# EAGLE design MotorControl (EAGLE 7.5.0)

## Sheet 1 of 4
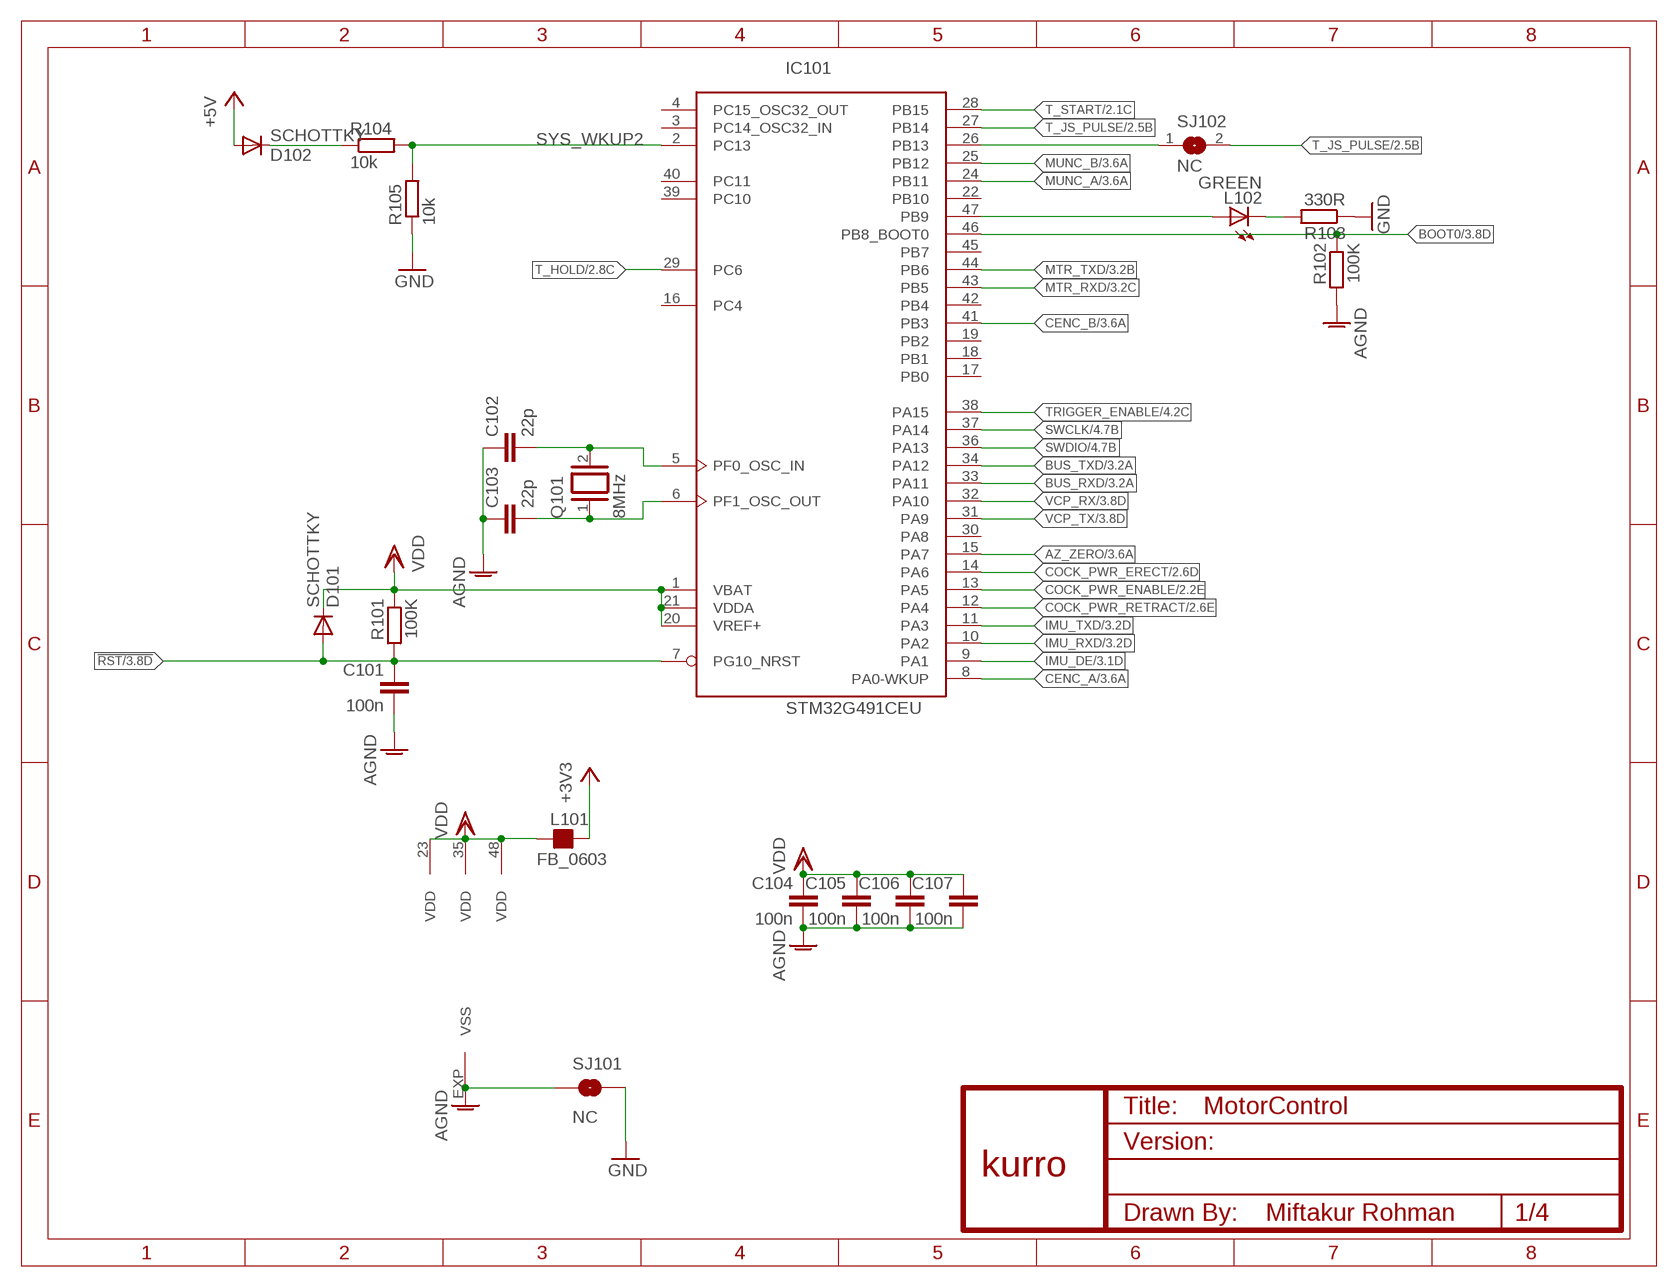
[diagram p0: schematic, sheet 1]

### Parts
C101  100n  C-EUC0603  [C0603]
C102  22p  C-EUC0603  [C0603]
C103  22p  C-EUC0603  [C0603]
C104  100n  C-EUC0603  [C0603]
C105  100n  C-EUC0603  [C0603]
C106  100n  C-EUC0603  [C0603]
C107  100n  C-EUC0603  [C0603]
D101  SCHOTTKY  DIODE-MICROMELF-W  [MICROMELF-W]
D102  SCHOTTKY  DIODE-MICROMELF-W  [MICROMELF-W]
IC101  STM32G491CEU  [UFQFPN48]
L101  FB_0603  [L0603]
L102  GREEN  LEDCHIP-LED0805  [CHIP-LED0805]
Q101  8MHz  XTAL/S  [QS]
R101  100K  R-EU_R0603  [R0603]
R102  100K  R-EU_R0603  [R0603]
R103  330R  R-EU_R0603  [R0603]
R104  10k  R-EU_R0603  [R0603]
R105  10k  R-EU_R0603  [R0603]
SJ101  NC  SOLDERJUMPERTRACE_THICK  [SJ_2S-TRACE_THICK]
SJ102  NC  SJS  [SJS]
U$1  KURRO_FOOTPRINT  [KURRO-LOGO]

### Nets
!RST [ic]: C101.1 D101.A IC101.7(PG10_NRST) R101.2 ; also sheet 3
+3V3: L101.2 ; also sheet 2,3
+5V: D102.A ; also sheet 2,3,4
AGND [ic]: C101.2 C102.1 C103.1 C104.2 C105.2 C106.2 C107.2 IC101.EXP(VSS) R102.2 SJ101.1
AZ_ZERO [ic]: IC101.15(PA7) ; also sheet 3
BOOT0 [ic]: IC101.46(PB8_BOOT0) R102.1 ; also sheet 3
BUS_RXD [ic]: IC101.33(PA11) ; also sheet 3
BUS_TXD [ic]: IC101.34(PA12) ; also sheet 3
CENC_A: IC101.8(PA0-WKUP) ; also sheet 3
CENC_B: IC101.41(PB3) ; also sheet 3
COCK_PWR_ENABLE [ic]: IC101.13(PA5) ; also sheet 2
COCK_PWR_ERECT [ic]: IC101.14(PA6) ; also sheet 2
COCK_PWR_RETRACT [ic]: IC101.12(PA4) ; also sheet 2
GND: R103.1 R105.1 SJ101.2 ; also sheet 2,3,4
IMU_DE: IC101.9(PA1) ; also sheet 3
IMU_RXD: IC101.10(PA2) ; also sheet 3
IMU_TXD: IC101.11(PA3) ; also sheet 3
MTR_RXD [ic]: IC101.43(PB5) ; also sheet 3
MTR_TXD [ic]: IC101.44(PB6) ; also sheet 3
MUNC_A: IC101.24(PB11) ; also sheet 3
MUNC_B: IC101.25(PB12) ; also sheet 3
N$4: IC101.47(PB9) L102.A
N$9: L102.C R103.2
N$11: D102.C R104.1
N$25 [ic]: C103.2 IC101.6(PF1_OSC_OUT) Q101.1
N$26: IC101.26(PB13) SJ102.1
N$31 [ic]: C102.2 IC101.5(PF0_OSC_IN) Q101.2
SWCLK [ic]: IC101.37(PA14) ; also sheet 4
SWDIO [ic]: IC101.36(PA13) ; also sheet 4
SYS_WKUP2: IC101.2(PC13) R104.2 R105.2
T_HOLD: IC101.29(PC6) ; also sheet 2
T_JS_PULSE: IC101.27(PB14) SJ102.2 ; also sheet 2
T_START: IC101.28(PB15) ; also sheet 2
TRIGGER_ENABLE [ic]: IC101.38(PA15) ; also sheet 4
VCP_RX [ic]: IC101.32(PA10) ; also sheet 3,4
VCP_TX [ic]: IC101.31(PA9) ; also sheet 3,4
VDD [ic]: C104.1 C105.1 C106.1 C107.1 D101.C IC101.1(VBAT) IC101.20(VREF+) IC101.21(VDDA) IC101.23(VDD) IC101.35(VDD) IC101.48(VDD) L101.1 R101.1 ; also sheet 2,4
Unconnected: IC101.3(PC14_OSC32_IN) IC101.4(PC15_OSC32_OUT) IC101.16(PC4) IC101.17(PB0) IC101.18(PB1) IC101.19(PB2) IC101.22(PB10) IC101.30(PA8) IC101.39(PC10) IC101.40(PC11) IC101.42(PB4) IC101.45(PB7)

## Sheet 2 of 4
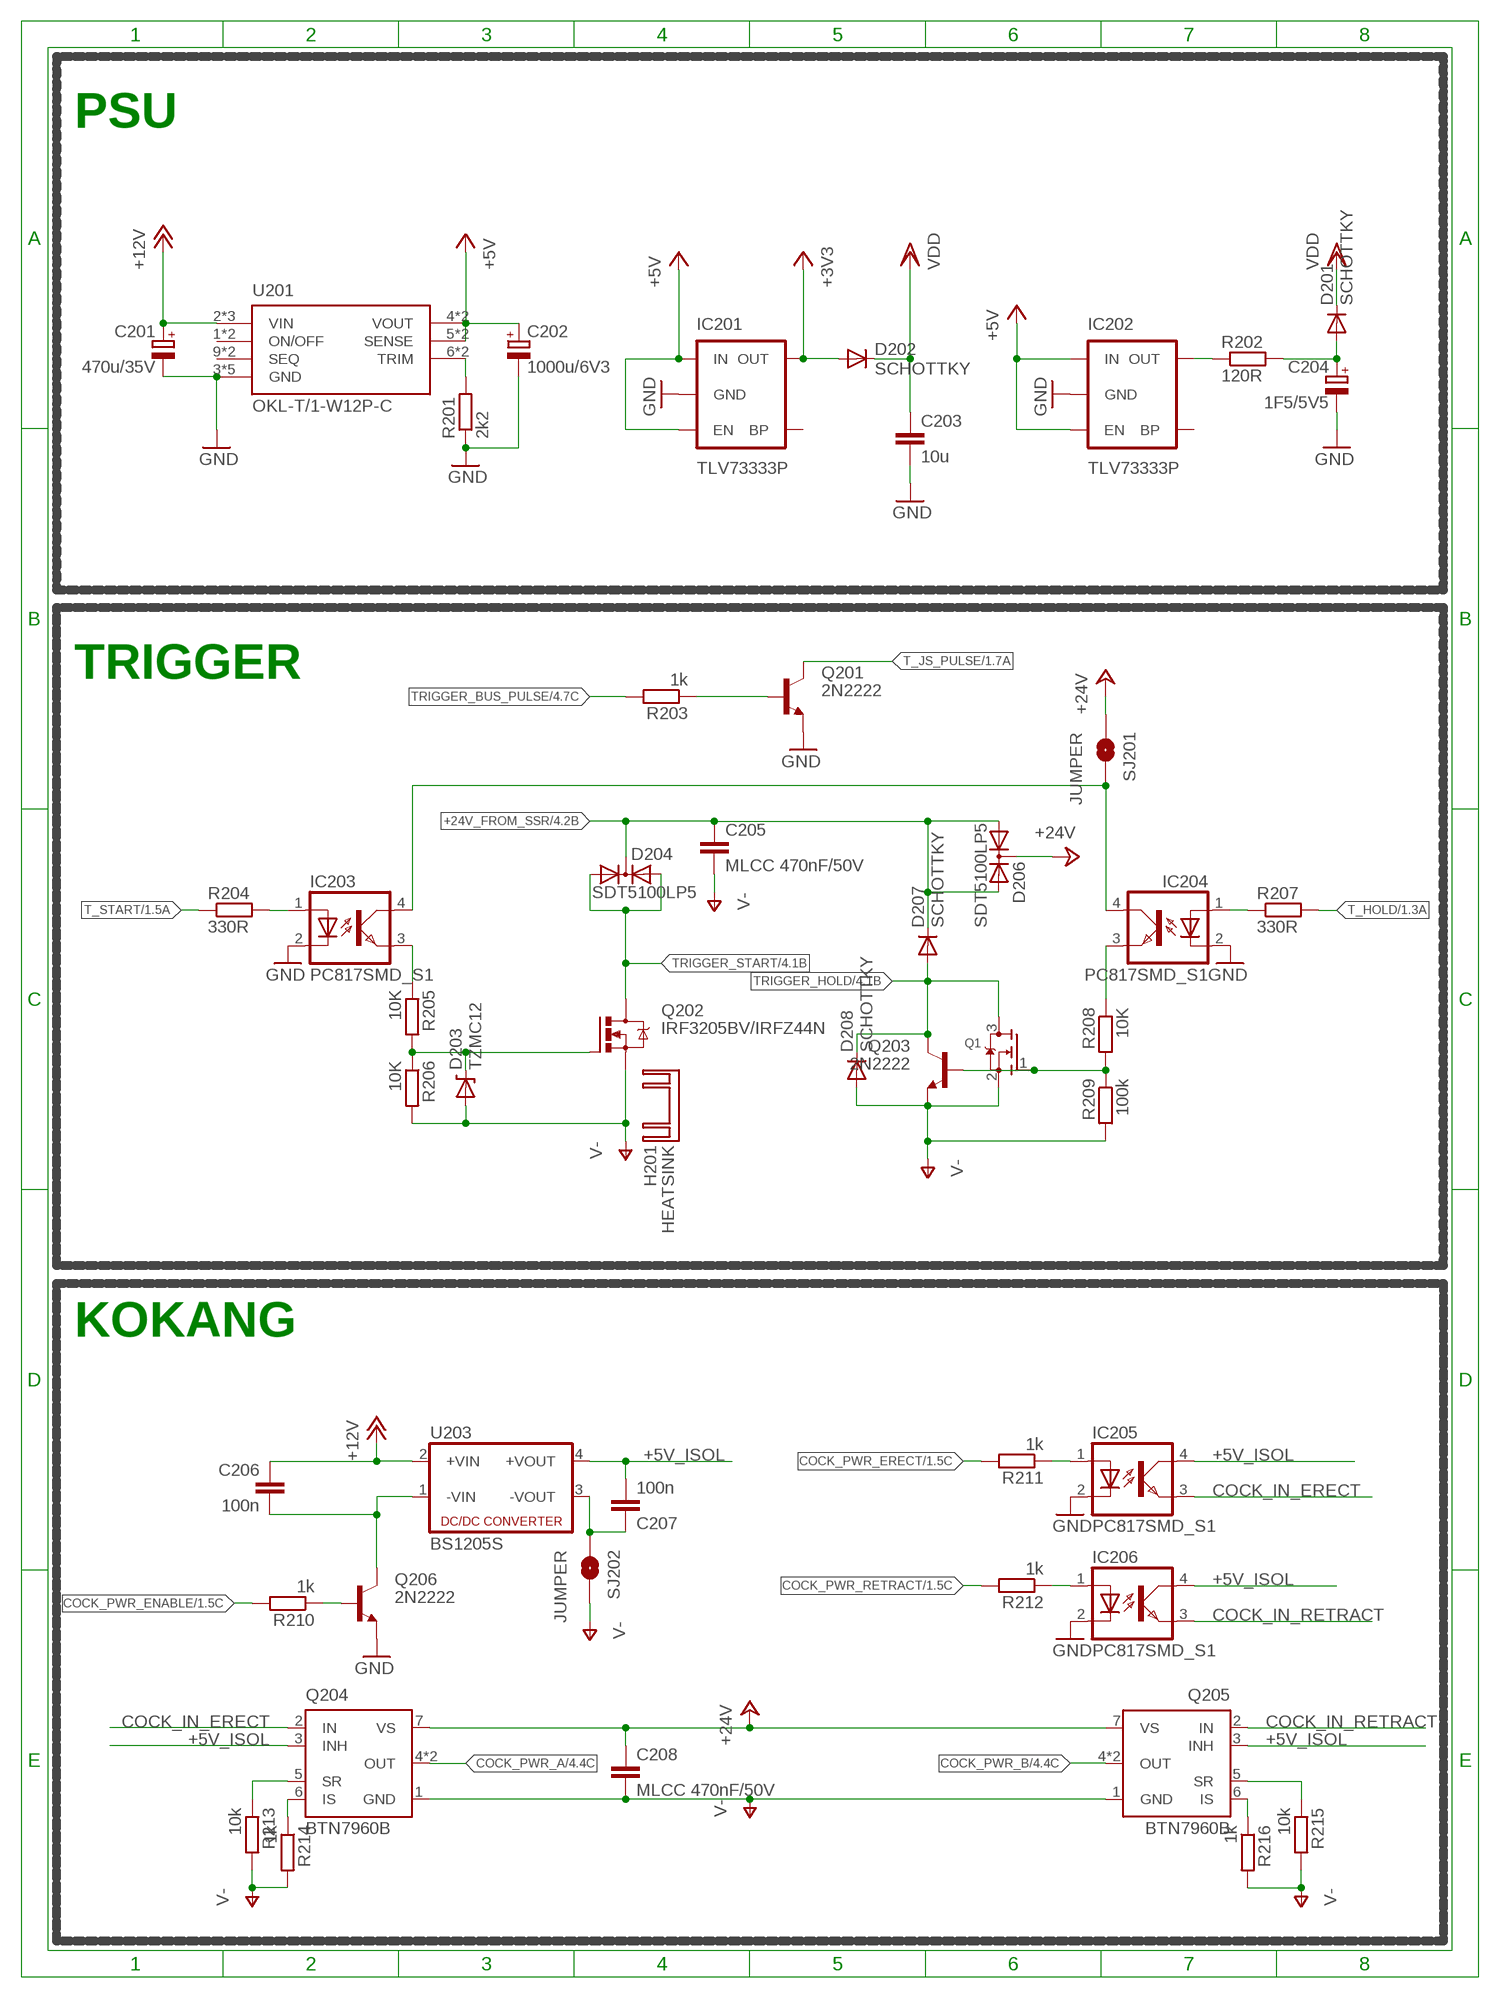
[diagram p1: schematic, sheet 2]

### Parts
C201  470u/35V  CPOL-EU153CLV-1012  [153CLV-1012]
C202  1000u/6V3  CPOL-EU153CLV-0810  [153CLV-0810]
C203  10u  C-EUC0805  [C0805]
C204  1F5/5V5  SUPER_CAP_1F/5V5  [SC_1F/5V5]
C205  MLCC 470nF/50V  C-EU150-064X183  [C150-064X183]
C206  100n  C-EUC0603  [C0603]
C207  100n  C-EUC0603  [C0603]
C208  MLCC 470nF/50V  C-EU150-064X183  [C150-064X183]
D201  SCHOTTKY  DIODE-MICROMELF-W  [MICROMELF-W]
D202  SCHOTTKY  DIODE-MICROMELF-W  [MICROMELF-W]
D203  TZMC12  DIODE-ZENERSMB  [SMB-DIODE]
D204  SDT5100LP5  [POWERDI5-3]
D206  SDT5100LP5  [POWERDI5-3]
D207  SCHOTTKY  DIODE-MICROMELF-W  [MICROMELF-W]
D208  SCHOTTKY  DIODE-MICROMELF-W  [MICROMELF-W]
H201  HEATSINK  TO220T25-HOLE  [BV_240X170-HOLE]
IC201  TLV73333P  V_REG_LDOSMD  [SOT23-5]
IC202  TLV73333P  V_REG_LDOSMD  [SOT23-5]
IC203  PC817SMD_S1  [PC817SMD]
IC204  PC817SMD_S1  [PC817SMD]
IC205  PC817SMD_S1  [PC817SMD]
IC206  PC817SMD_S1  [PC817SMD]
Q1  AO3404-REFLOW  [SOT23]
Q201  2N2222  2N2222-REFLOW  [SOT23]
Q202  IRF3205BV/IRFZ44N  IRF3205BV  [TO220BV]
Q203  2N2222  2N2222-REFLOW  [SOT23]
Q204  BTN7960B  BTN8982  [PG-TO263-7-1]
Q205  BTN7960B  BTN8982  [PG-TO263-7-1]
Q206  2N2222  2N2222-REFLOW  [SOT23]
R201  2k2  R-EU_R0603  [R0603]
R202  120R  R-EU_R0603  [R0603]
R203  1k  R-EU_R0603  [R0603]
R204  330R  R-EU_R0603  [R0603]
R205  10K  R-EU_R0603  [R0603]
R206  10K  R-EU_R0603  [R0603]
R207  330R  R-EU_R0603  [R0603]
R208  10K  R-EU_R0603  [R0603]
R209  100k  R-EU_R0603  [R0603]
R210  1k  R-EU_R0603  [R0603]
R211  1k  R-EU_R0603  [R0603]
R212  1k  R-EU_R0603  [R0603]
R213  10k  R-EU_R0603  [R0603]
R214  1k  R-EU_R0603  [R0603]
R215  10k  R-EU_R0603  [R0603]
R216  1k  R-EU_R0603  [R0603]
SJ201  JUMPER  SOLDERJUMPERTRACE_THICK  [SJ_2S-TRACE_THICK]
SJ202  JUMPER  SOLDERJUMPERTRACE_THICK  [SJ_2S-TRACE_THICK]
U201  OKL-T/1-W12P-C  OKL2T/3W5NC_SMD  [OKL2T/3W5NC]
U203  BS1205S  NME  [NME]

### Nets
+3V3: D202.A IC201.5(OUT) ; also sheet 1,3
+5V: C202.+ IC201.1(IN) IC201.3(EN) IC202.1(IN) IC202.3(EN) U201.4(VOUT) U201.4@1(VOUT) U201.5(SENSE) U201.5@1(SENSE) ; also sheet 1,3,4
+5V_ISOL: C207.2 IC205.4(COL) IC206.4(COL) Q204.3(INH) Q205.3(INH) U203.4(+VOUT)
+12V [power]: C201.+ C206.1 U201.2(VIN) U201.2@1(VIN) U201.2@2(VIN) U203.2(+VIN) ; also sheet 4
+24V [power]: C208.1 D206.3 Q204.7(VS) Q205.7(VS) SJ201.1 ; also sheet 4
+24V_FROM_SSR [power]: C205.1 D204.3 D206.1 D206.2 D207.C ; also sheet 4
COCK_IN_ERECT: IC205.3(EMIT) Q204.2(IN)
COCK_IN_RETRACT: IC206.3(EMIT) Q205.2(IN)
COCK_PWR_A [power]: Q204.4(OUT) Q204.8(OUT) ; also sheet 4
COCK_PWR_B [power]: Q205.4(OUT) Q205.8(OUT) ; also sheet 4
COCK_PWR_ENABLE [ic]: R210.2 ; also sheet 1
COCK_PWR_ERECT [ic]: R211.2 ; also sheet 1
COCK_PWR_RETRACT [ic]: R212.2 ; also sheet 1
COCK_SENSOR1: Q204.6(IS) R214.1
GND: C201.- C202.- C203.2 C204.2(-) IC201.2(GND) IC202.2(GND) IC203.2(C) IC204.2(C) IC205.2(C) IC206.2(C) Q201.2(E) Q206.2(E) R201.1 U201.3(GND) U201.3@1(GND) U201.3@2(GND) U201.7(GND) U201.7@1(GND) ; also sheet 1,3,4
N$1: IC203.4(COL) IC204.4(COL) SJ201.2
N$5: Q204.5(SR) R213.1
N$6: Q205.5(SR) R215.1
N$7: Q205.6(IS) R216.1
N$15: Q206.1(B) R210.1
N$16: C206.2 Q206.3(C) U203.1(-VIN)
N$17: Q201.1(B) R203.1
N$18: IC205.1(A) R211.1
N$19: R201.2 U201.6(TRIM) U201.6@1(TRIM)
N$22: IC206.1(A) R212.1
N$24: C207.1 SJ202.1 U203.3(-VOUT)
N$38: D203.C Q202.G R205.2 R206.1
N$40: Q1.1(G) Q203.1(B) R208.2 R209.1
N$41: IC203.3(EMIT) R205.1
N$42: IC204.3(EMIT) R208.1
N$43: IC204.1(A) R207.1
N$44: IC203.1(A) R204.2
N$46: IC202.5(OUT) R202.1
T_HOLD: R207.2 ; also sheet 1
T_JS_PULSE: Q201.3(C) ; also sheet 1
T_START: R204.1 ; also sheet 1
TRIGGER_BUS_PULSE [ic]: R203.2 ; also sheet 4
TRIGGER_HOLD [power]: D207.A D208.C Q1.3(D) Q203.3(C) ; also sheet 4
TRIGGER_START [power]: D204.1 D204.2 Q202.D ; also sheet 4
V- [power]: C205.2 C208.2 D203.A D208.A Q1.2(S) Q202.S Q203.2(E) Q204.1(GND) Q205.1(GND) R206.2 R209.2 R213.2 R214.2 R215.2 R216.2 SJ202.2 ; also sheet 4
V_SCAP: C204.1(+) D201.A R202.2
VDD [ic]: C203.1 D201.C D202.C ; also sheet 1,4
Unconnected: IC201.4(BP) IC202.4(BP) U201.1(ON/OFF) U201.1@1(ON/OFF) U201.9(SEQ) U201.9@1(SEQ)

### Notes on the sheet
- PSU
- TRIGGER
- KOKANG

## Sheet 3 of 4
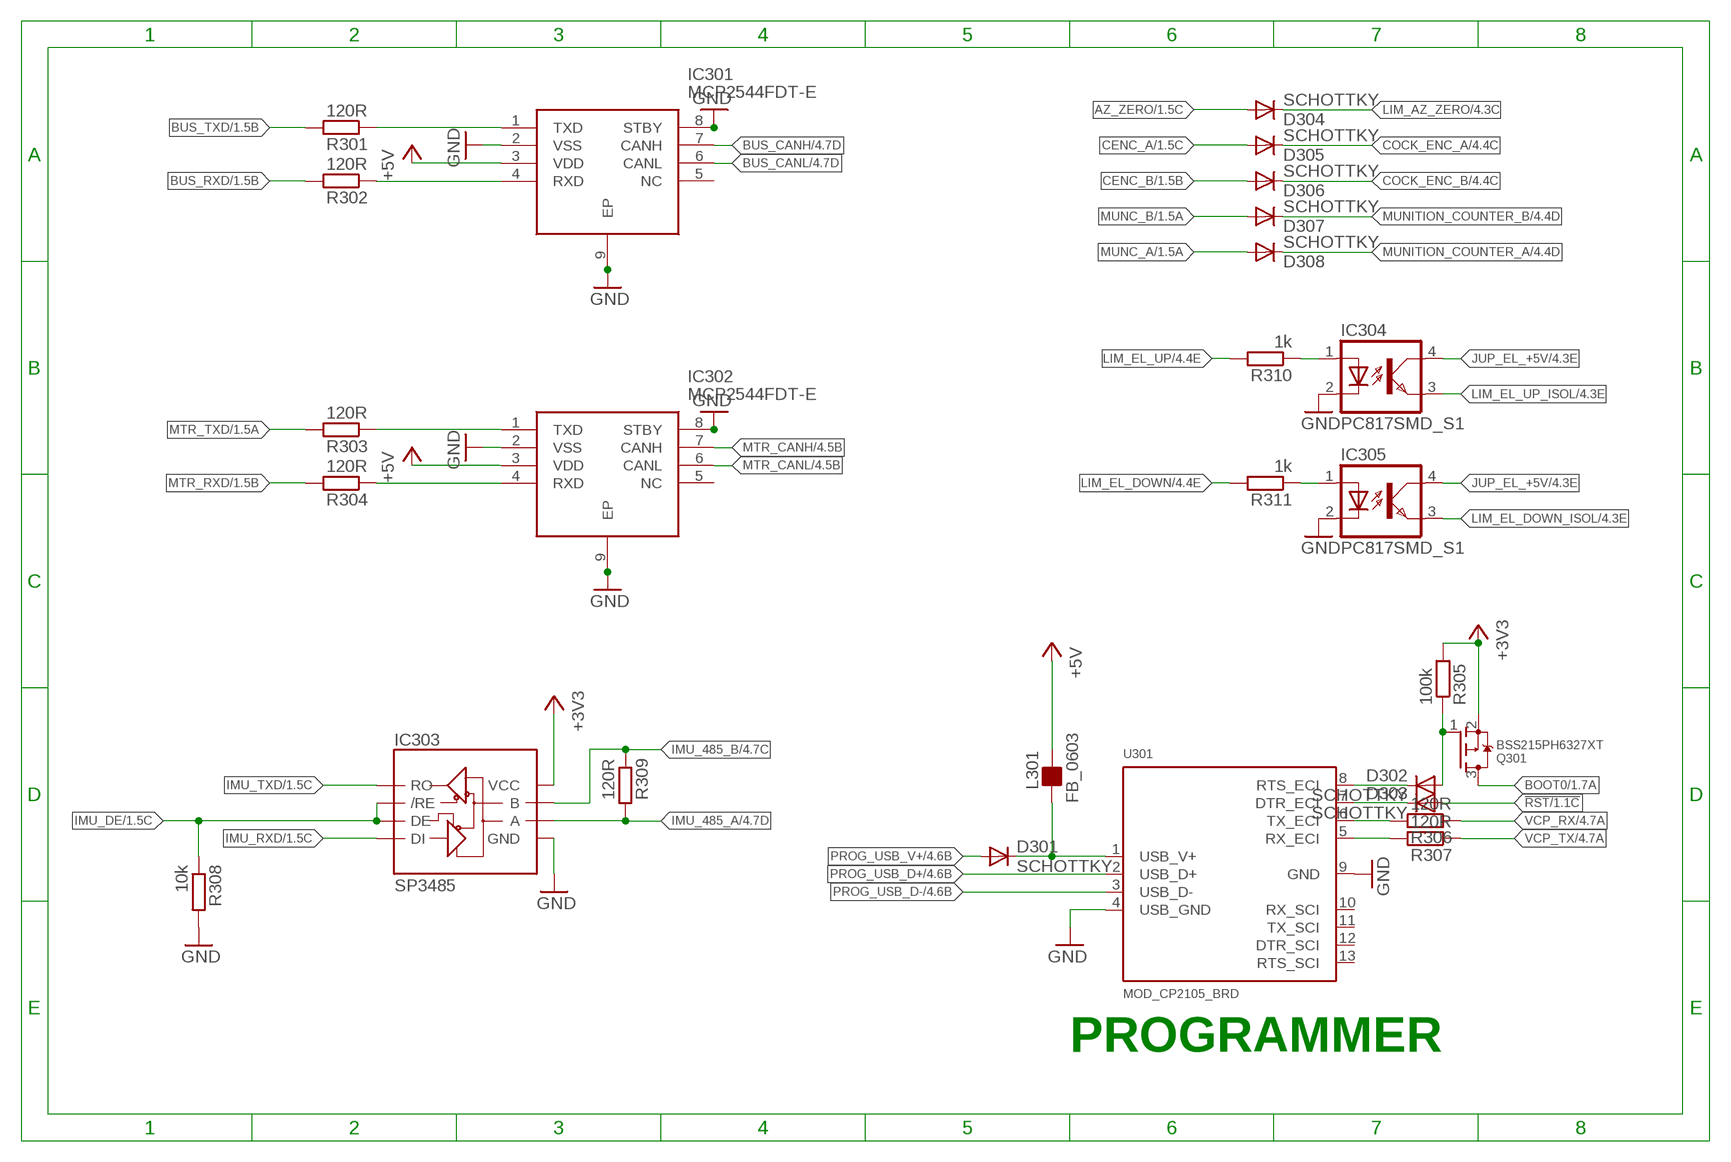
[diagram p2: schematic, sheet 3]

### Parts
D301  SCHOTTKY  DIODE-MICROMELF-W  [MICROMELF-W]
D302  SCHOTTKY  DIODE-MICROMELF-W  [MICROMELF-W]
D303  SCHOTTKY  DIODE-MICROMELF-W  [MICROMELF-W]
D304  SCHOTTKY  DIODE-MICROMELF-W  [MICROMELF-W]
D305  SCHOTTKY  DIODE-MICROMELF-W  [MICROMELF-W]
D306  SCHOTTKY  DIODE-MICROMELF-W  [MICROMELF-W]
D307  SCHOTTKY  DIODE-MICROMELF-W  [MICROMELF-W]
D308  SCHOTTKY  DIODE-MICROMELF-W  [MICROMELF-W]
IC301  MCP2544FDT-E  [TDFN-8]
IC302  MCP2544FDT-E  [TDFN-8]
IC303  SP3485  RS485SOIC  [SO08]
IC304  PC817SMD_S1  [PC817SMD]
IC305  PC817SMD_S1  [PC817SMD]
L301  FB_0603  [L0603]
Q301  BSS215PH6327XT  A03401-WIDE  [SOT23-W]
R301  120R  R-EU_R0603  [R0603]
R302  120R  R-EU_R0603  [R0603]
R303  120R  R-EU_R0603  [R0603]
R304  120R  R-EU_R0603  [R0603]
R305  100k  R-EU_R0603  [R0603]
R306  120R  R-EU_R0603  [R0603]
R307  120R  R-EU_R0603  [R0603]
R308  10k  R-EU_R0603  [R0603]
R309  120R  R-EU_R0603  [R0603]
R310  1k  R-EU_R0603  [R0603]
R311  1k  R-EU_R0603  [R0603]
U301  MOD_CP2105_BRD  [MOD_CP2105_BOARD]

### Nets
!RST [ic]: D303.A ; also sheet 1
+3V3: IC303.8(VCC) Q301.2(S) R305.2 ; also sheet 1,2
+5V: IC301.3(VDD) IC302.3(VDD) L301.2 ; also sheet 1,2,4
AZ_ZERO [ic]: D304.A ; also sheet 1
BOOT0 [ic]: Q301.3(D) ; also sheet 1
BUS_CANH: IC301.7(CANH) ; also sheet 4
BUS_CANL: IC301.6(CANL) ; also sheet 4
BUS_RXD [ic]: R302.2 ; also sheet 1
BUS_TXD [ic]: R301.2 ; also sheet 1
CENC_A: D305.A ; also sheet 1
CENC_B: D306.A ; also sheet 1
COCK_ENC_A: D305.C ; also sheet 4
COCK_ENC_B: D306.C ; also sheet 4
GND: IC301.2(VSS) IC301.8(STBY) IC301.9(EP) IC302.2(VSS) IC302.8(STBY) IC302.9(EP) IC303.5(GND) IC304.2(C) IC305.2(C) R308.2 U301.4(USB_GND) U301.9(GND) ; also sheet 1,2,4
IMU_485_A: IC303.6(A) R309.2 ; also sheet 4
IMU_485_B: IC303.7(B) R309.1 ; also sheet 4
IMU_DE: IC303.2(/RE) IC303.3(DE) R308.1 ; also sheet 1
IMU_RXD: IC303.4(DI) ; also sheet 1
IMU_TXD: IC303.1(RO) ; also sheet 1
JUP_EL_+5V: IC304.4(COL) IC305.4(COL) ; also sheet 4
LIM_AZ_ZERO [ic]: D304.C ; also sheet 4
LIM_EL_DOWN: R311.2 ; also sheet 4
LIM_EL_DOWN_ISOL: IC305.3(EMIT) ; also sheet 4
LIM_EL_UP: R310.2 ; also sheet 4
LIM_EL_UP_ISOL: IC304.3(EMIT) ; also sheet 4
MTR_CANH: IC302.7(CANH) ; also sheet 4
MTR_CANL: IC302.6(CANL) ; also sheet 4
MTR_RXD [ic]: R304.2 ; also sheet 1
MTR_TXD [ic]: R303.2 ; also sheet 1
MUNC_A: D308.A ; also sheet 1
MUNC_B: D307.A ; also sheet 1
MUNITION_COUNTER_A: D308.C ; also sheet 4
MUNITION_COUNTER_B: D307.C ; also sheet 4
N$3: IC304.1(A) R310.1
N$8: R307.2 U301.5(RX_ECI)
N$10: R306.2 U301.6(TX_ECI)
N$12: D303.C U301.7(DTR_ECI)
N$13: D302.C U301.8(RTS_ECI)
N$14: D301.C L301.1 U301.1(USB_V+)
N$20: D302.A Q301.1(G) R305.1
N$21: IC305.1(A) R311.1
N$34: IC301.4(RXD) R302.1
N$35: IC301.1(TXD) R301.1
N$36: IC302.4(RXD) R304.1
N$37: IC302.1(TXD) R303.1
PROG_USB_D+: U301.2(USB_D+) ; also sheet 4
PROG_USB_D-: U301.3(USB_D-) ; also sheet 4
PROG_USB_V+: D301.A ; also sheet 4
VCP_RX [ic]: R306.1 ; also sheet 1,4
VCP_TX [ic]: R307.1 ; also sheet 1,4
Unconnected: IC301.5(NC) IC302.5(NC) U301.10(RX_SCI) U301.11(TX_SCI) U301.12(DTR_SCI) U301.13(RTS_SCI)

### Notes on the sheet
- PROGRAMMER

## Sheet 4 of 4
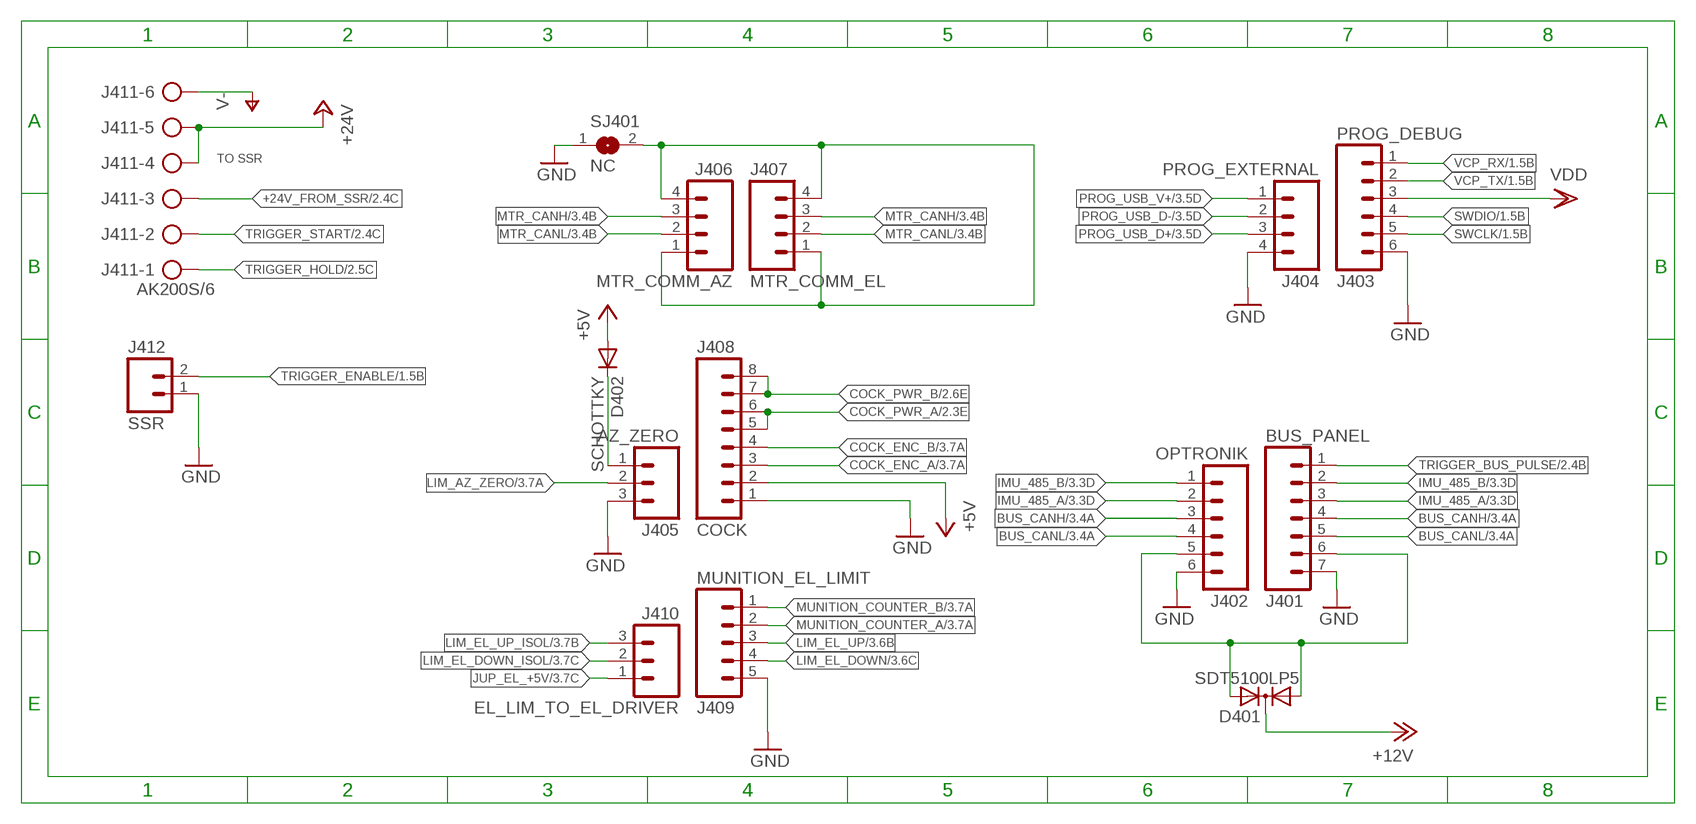
[diagram p3: schematic, sheet 4]

### Parts
D401  SDT5100LP5  [POWERDI5-3]
D402  SCHOTTKY  DIODE-MICROMELF-W  [MICROMELF-W]
J401  BUS_PANEL  M07-XHS-RA  [XHS-7-RA]
J402  OPTRONIK  M06-XHS-RA  [XHS-6-RA]
J403  PROG_DEBUG  M06-XHS-VERT-SMD  [XHS-6-VERT-SMD]
J404  PROG_EXTERNAL  M04-XHS-RA  [XHS-4-RA]
J405  AZ_ZERO  M03-XHS-RA  [XHS-3-RA]
J406  MTR_COMM_AZ  M04  [MICRO_MATCH_04]
J407  MTR_COMM_EL  M04  [MICRO_MATCH_04]
J408  COCK  M08-XHS-RA  [XHS-8-RA]
J409  MUNITION_EL_LIMIT  M05-XHS-RA  [XHS-5-RA]
J410  EL_LIM_TO_EL_DRIVER  M03-XHS-RA  [XHS-3-RA]
J411  AK200S/6  [AK200S/6]
J412  SSR  M02-XHS-RA  [XHS-2-RA]
SJ401  NC  SJS  [SJS]

### Nets
+5V: D402.A J408.2 ; also sheet 1,2,3
+12V [power]: D401.3 ; also sheet 2
+24V [power]: J411.4 J411.5 ; also sheet 2
+24V_FROM_SSR [power]: J411.3 ; also sheet 2
BUS_CANH: J401.4 J402.3 ; also sheet 3
BUS_CANL: J401.5 J402.4 ; also sheet 3
COCK_ENC_A: J408.3 ; also sheet 3
COCK_ENC_B: J408.4 ; also sheet 3
COCK_PWR_A [power]: J408.5 J408.6 ; also sheet 2
COCK_PWR_B [power]: J408.7 J408.8 ; also sheet 2
GND: J401.7 J402.6 J403.6 J404.4 J405.3 J408.1 J409.5 J412.1 SJ401.1 ; also sheet 1,2,3
IMU_485_A: J401.3 J402.2 ; also sheet 3
IMU_485_B: J401.2 J402.1 ; also sheet 3
JUP_EL_+5V: J410.1 ; also sheet 3
LIM_AZ_ZERO [ic]: J405.2 ; also sheet 3
LIM_EL_DOWN: J409.4 ; also sheet 3
LIM_EL_DOWN_ISOL: J410.2 ; also sheet 3
LIM_EL_UP: J409.3 ; also sheet 3
LIM_EL_UP_ISOL: J410.3 ; also sheet 3
MTR_CANH: J406.3 J407.3 ; also sheet 3
MTR_CANL: J406.2 J407.2 ; also sheet 3
MUNITION_COUNTER_A: J409.2 ; also sheet 3
MUNITION_COUNTER_B: J409.1 ; also sheet 3
N$2: D402.C J405.1
N$23: J406.1 J406.4 J407.1 J407.4 SJ401.2
N$33 [power]: D401.1 D401.2 J401.6 J402.5
PROG_USB_D+: J404.3 ; also sheet 3
PROG_USB_D-: J404.2 ; also sheet 3
PROG_USB_V+: J404.1 ; also sheet 3
SWCLK [ic]: J403.5 ; also sheet 1
SWDIO [ic]: J403.4 ; also sheet 1
TRIGGER_BUS_PULSE [ic]: J401.1 ; also sheet 2
TRIGGER_ENABLE [ic]: J412.2 ; also sheet 1
TRIGGER_HOLD [power]: J411.1 ; also sheet 2
TRIGGER_START [power]: J411.2 ; also sheet 2
V- [power]: J411.6 ; also sheet 2
VCP_RX [ic]: J403.1 ; also sheet 1,3
VCP_TX [ic]: J403.2 ; also sheet 1,3
VDD [ic]: J403.3 ; also sheet 1,2

### Notes on the sheet
- TO SSR

## Library data of the parts
C101 C104-C107 C206 C207 = resistor:C-EU: CAPACITOR, European symbol
C102 C103 C203 C205 C208 = rcl:C-EU: CAPACITOR, European symbol
C201 C202 = resistor:CPOL-EU: POLARIZED CAPACITOR, European symbol
C204 = rcws:SUPER_CAP
D101 D102 D201 D202 D207 D208 D301-D308 D402 = diode:DIODE-: DIODE
D203 = SparkFun:DIODE-ZENER: Zener Diode Production Part - 8199 3.4V Zener Voltage
D204 D206 D401 = rcws:SDT5100LP5
H201 = heatsink:TO220: HEATSINK Heatsink for TO220
IC101 = micro-stm_v3.1:STM32G491C*U: ARM 32-bit Cortex™-M4+ CPU 170 MHz maximum frequency 256 to 512 Kbytes of Flash memory 112 kbytes of SRAM 38 to 42 GPIOs 1.71 to 3.6 V application supply
IC201 IC202 = pixhawk2:V_REG_LDO: Voltage Regulator LDO Standard 150mA LDO voltage regulator in SOT-23 layout. Micrel part MIC5205. BP (by-pass) pin is used to lower output noise with 470pF cap.
IC203-IC206 IC304 IC305 = rcws:PC817
IC301 IC302 = rcws:MCP2544FDT-E
IC303 = SparkFun-DigitalIC:RS485: RS485 transceiver
J401 = SparkFun-Connectors:M07: Header 7 Standard 7-pin 0.1" header. Use with straight break away headers (SKU : PRT-00116), right angle break away headers (PRT-00553), swiss pins (PRT-00743), machine pins (PRT-00117), and female headers (PRT-00115). NOTES ON THE VARIANTS LOCK and LOCK_LONGPADS... This footprint was designed to help hold the alignment of a through-hole component (i.e. 7-pin header) while soldering it into place. You may notice that each hole has been shifted either up or down by 0.005 of an inch from it's more standard position (which is usually a perfectly straight line). This slight alteration caused the pins (the squares in the middle) to touch the edges of the holes. Because they are alternating, it causes a "brace" to hold the header in place. 0.005 has proven to be the perfect amount of "off-center" position when using our standard breakaway headers. Although looks a little odd when you look at the bare footprint, once you have a header in there, the alteration is very hard to notice. Also, if you push a header all the way into place, it is covered up entirely on the bottom side. This idea of altering the position of holes to aid alignment will be further integrated into the Sparkfun Library for other footprints. It can help hold any component with 3 or more connection pins.
J402 J403 = SparkFun-Connectors:M06: Header 6 Standard 6-pin 0.1" header. Use with straight break away headers (SKU : PRT-00116), right angle break away headers (PRT-00553), swiss pins (PRT-00743), machine pins (PRT-00117), and female headers (PRT-00115). Molex polarized connector foot print use with SKU : PRT-08094 with associated crimp pins and housings. NOTES ON THE VARIANTS LOCK and LOCK_LONGPADS... This footprint was designed to help hold the alignment of a through-hole component (i.e. 6-pin header) while soldering it into place. You may notice that each hole has been shifted either up or down by 0.005 of an inch from it's more standard position (which is a perfectly straight line). This slight alteration caused the pins (the squares in the middle) to touch the edges of the holes. Because they are alternating, it causes a "brace" to hold the component in place. 0.005 has proven to be the perfect amount of "off-center" position when using our standard breakaway headers. Although looks a little odd when you look at the bare footprint, once you have a header in there, the alteration is very hard to notice. Also,if you push a header all the way into place, it is covered up entirely on the bottom side. This idea of altering the position of holes to aid alignment will be further integrated into the Sparkfun Library for other footprints. It can help hold any component with 3 or more connection pins.
J404 = SparkFun-Connectors:M04: Header 4 Standard 4-pin 0.1" header. Use with straight break away headers (SKU : PRT-00116), right angle break away headers (PRT-00553), swiss pins (PRT-00743), machine pins (PRT-00117), and female headers (PRT-00115). Molex polarized connector foot print use with SKU : PRT-08231 with associated crimp pins and housings. 1MM SMD Version SKU: PRT-10208
J405 J410 = SparkFun-Connectors:M03: Header 3 Standard 3-pin 0.1" header. Use with straight break away headers (SKU : PRT-00116), right angle break away headers (PRT-00553), swiss pins (PRT-00743), machine pins (PRT-00117), and female headers (PRT-00115). Molex polarized connector foot print use with SKU : PRT-08232 with associated crimp pins and housings.
J406 J407 = rcws:M04
J408 = SparkFun-Connectors:M08: Header 8 Standard 8-pin 0.1" header. Use with straight break away headers (SKU : PRT-00116), right angle break away headers (PRT-00553), swiss pins (PRT-00743), machine pins (PRT-00117), and female headers (PRT-00115).
J409 = SparkFun-Connectors:M05: Header 5 Standard 5-pin 0.1" header. Use with straight break away headers (SKU : PRT-00116), right angle break away headers (PRT-00553), swiss pins (PRT-00743), machine pins (PRT-00117), and female headers (PRT-00115). Molex polarized connector foot print use with SKU : PRT-08230 with associated crimp pins and housings.
J411 = con-ptr500:AK200S/6
J412 = SparkFun-Connectors:M02: Standard 2-pin 0.1" header. Use with - straight break away headers ( PRT-00116) - right angle break away headers (PRT-00553) - swiss pins (PRT-00743) - machine pins (PRT-00117) - female headers (PRT-00115) Molex polarized connector foot print use with: PRT-08233 with associated crimp pins and housings. 2.54_SCREWTERM for use with PRT-10571. 3.5mm Screw Terminal footprints for PRT-08084 5mm Screw Terminal footprints for use with PRT-08433
L101 L301 = rc-master:FB_: FERRITE BEAD
L102 = led:LED: LED OSRAM: - CHIPLED LG R971, LG N971, LY N971, LG Q971, LY Q971, LO R971, LY R971 LH N974, LH R974 LS Q976, LO Q976, LY Q976 LO Q996 - Hyper CHIPLED LW Q18S LB Q993, LB Q99A, LB R99A - SideLED LS A670, LO A670, LY A670, LG A670, LP A670 LB A673, LV A673, LT A673, LW A673 LH A674 LY A675 LS A676, LA A676, LO A676, LY A676, LW A676 LS A679, LY A679, LG A679 - Hyper Micro SIDELED® LS Y876, LA Y876, LO Y876, LY Y876 LT Y87S - SmartLED LW L88C, LW L88S LB L89C, LB L89S, LG L890 LS L89K, LO L89K, LY L89K LS L896, LA L896, LO L896, LY L896 - TOPLED LS T670, LO T670, LY T670, LG T670, LP T670 LSG T670, LSP T670, LSY T670, LOP T670, LYG T670 LG T671, LOG T671, LSG T671 LB T673, LV T673, LT T673, LW T673 LH T674 LS T676, LA T676, LO T676, LY T676, LB T676, LH T676, LSB T676, LW T676 LB T67C, LV T67C, LT T67C, LS T67K, LO T67K, LY T67K, LW E67C LS E67B, LA E67B, LO E67B, LY E67B, LB E67C, LV E67C, LT E67C LW T67C LS T679, LY T679, LG T679 LS T770, LO T770, LY T770, LG T770, LP T770 LB T773, LV T773, LT T773, LW T773 LH T774 LS E675, LA E675, LY E675, LS T675 LS T776, LA T776, LO T776, LY T776, LB T776 LHGB T686 LT T68C, LB T68C - Hyper Mini TOPLED® LB M676 - Mini TOPLED Santana® LG M470 LS M47K, LO M47K, LY M47K Source: http://www.osram.convergy.de LUXEON: - LUMILED® LXK2-PW12-R00, LXK2-PW12-S00, LXK2-PW14-U00, LXK2-PW14-V00 LXK2-PM12-R00, LXK2-PM12-S00, LXK2-PM14-U00 LXK2-PE12-Q00, LXK2-PE12-R00, LXK2-PE12-S00, LXK2-PE14-T00, LXK2-PE14-U00 LXK2-PB12-K00, LXK2-PB12-L00, LXK2-PB12-M00, LXK2-PB14-N00, LXK2-PB14-P00, LXK2-PB14-Q00 LXK2-PR12-L00, LXK2-PR12-M00, LXK2-PR14-Q00, LXK2-PR14-R00 LXK2-PD12-Q00, LXK2-PD12-R00, LXK2-PD12-S00 LXK2-PH12-R00, LXK2-PH12-S00 LXK2-PL12-P00, LXK2-PL12-Q00, LXK2-PL12-R00 Source: www.luxeon.com KINGBRIGHT: KA-3528ASYC Source: www.kingbright.com
Q1 = rcws:AO3404*: 30V N-Channel MOSFET Feature: ID (at VGS=10V) 5A RDS(ON) (at VGS=10V) <31mOhm RDS(ON) (at VGS =4.5V) <43mOhm datasheet <http://www.aosmd.com/pdfs/datasheet/AO3404.pdf> tokopedia <https://www.tokopedia.com/tokopuwei/ao3404-ao3404a-a49t-ao-3404-sot23-30v-n-channel-mosfet-az25>
Q101 = special:XTAL/S: CRYSTAL
Q201 Q203 Q206 = scorpion:2N2222*
Q202 = transistor-power:IRF3205: N-CHANNEL HEXFET POWER MOSFET ID (MAX)= 110A
Q204 = infineon:BTN8982; PARTNO: BTN7960B
Q205 = infineon:BTN8982; BOM: INCLUDE
Q301 = rcws:A03401*: 30V P-Channel MOSFET Feature: VDS: -30V ID (at VGS=10V): -4A RDS(ON) (at VGS=10V): <50mOhm RDS(ON) (at VGS = 4.5V): <60mOhm RDS(ON) (at VGS = 2.5V): <85mOhm datasheet <http://www.aosmd.com/pdfs/datasheet/AO3401.pdf> tokopedia <https://www.tokopedia.com/tokopuwei/mosfet-ao3401-fet-ao3401-sot23-p-channel-30v-4a-a19t-sot-23-az37>
R101-R105 R301-R311 = resistor:R-EU_: RESISTOR, European symbol
R201-R204 R207 R210-R213 = rcl:R-EU_: RESISTOR, European symbol
R205 R206 R208 R209 R214-R216 = rcl:R-EU_: RESISTOR, European symbol; BOM: INCLUDE
SJ101 SJ201 SJ202 = SparkFun:SOLDERJUMPER: Solder Jumper Standard SMD solder jumper. Used to automate production. Two varients : Normally Open and Normally Closed are the same, but have different paste layers. NC will have a large amount of paste and should jumper during reflow.
SJ102 SJ401 = jumper:SJ: SMD solder JUMPER
U201 = encPhone:OKL2T/3W5NC
U203 = dc-dc-converter:NME: DC-DC CONVERTER
U301 = rcws:MOD_CP2105
U$1 = SparkFun:KURRO_FOOTPRINT

## Net classes
0 default: width 0.203 mm, drill 0.29 mm, clearance 0.203 mm
1 ic: width 0.203 mm, drill 0.29 mm, clearance 0.203 mm
2 power: width 0.406 mm, drill 0.29 mm, clearance 0.457 mm

## Board
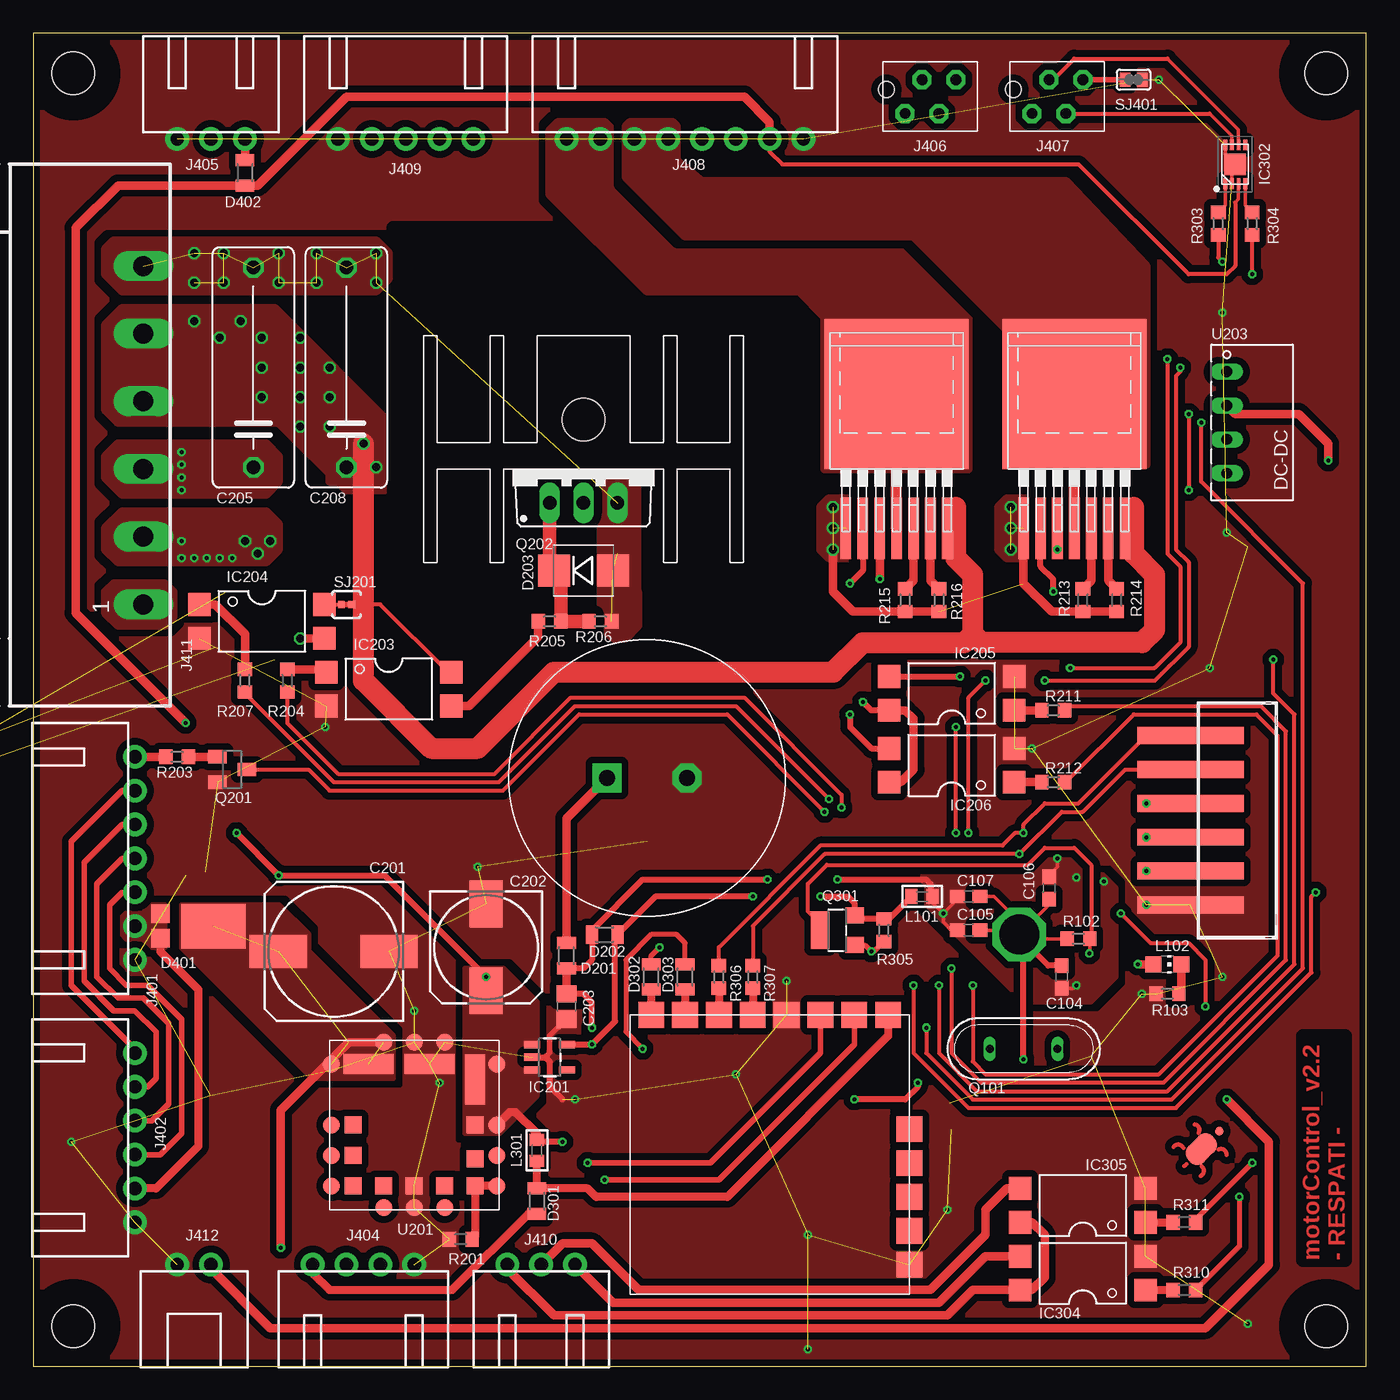
[diagram p4: board, top side]
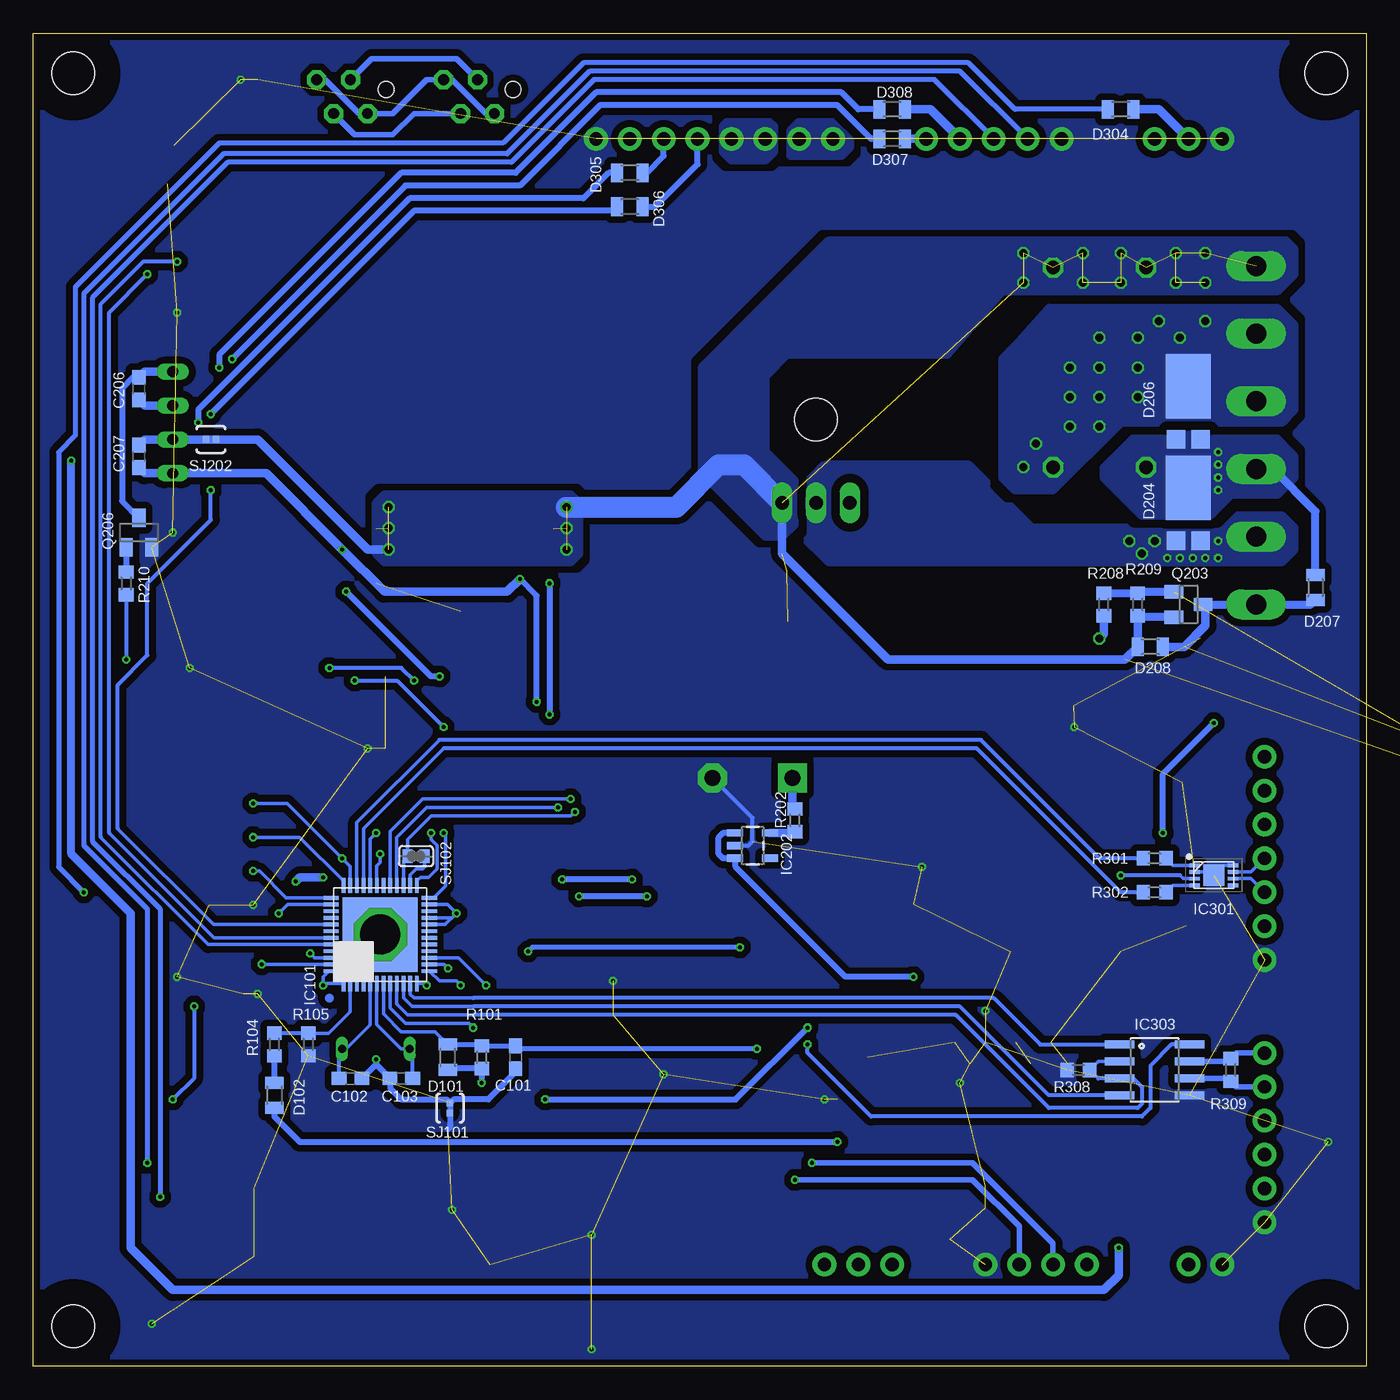
[diagram p5: board, bottom side, seen from below]

Size 100 x 100 mm. Coordinates in mm from the lower left corner, seen from the top.
Outline: 0,0 100,0 100,100 0,100 0,0
Copper layers (1*16): Top 0.035mm / dielectric 1.5mm / Bottom 0.035mm
Design rules "pcbgogo *": minimum track width 6mil, minimum drill 0.29mm, track to track 6mil, track to pad 6mil, pad to pad 6mil, via to via 6mil, smd to smd 0mil, copper to edge 0.4mm, drill to drill 0.25mm, minimum pad ring 6mil, minimum via ring 6mil, stop-mask expansion 4mil, vias tented up to drill 0.65mm, thermal gap 10mil
Holes 3.2 mm at 3,3 3,97 97,97 97,3
tRestrict: area 0,0 to 6,6; area 94,0 to 100,6; area 94,94 to 100,100; area 0,94 to 6,100; area 27,84.8 to 39.4,85.4; 8 lines
bRestrict: area 0,0 to 6,6; area 94,0 to 100,6; area 94,94 to 100,100; area 0,94 to 6,100

### Footprints (pad centres in the part's own frame; a part is rotated, then mirrored left to right if it is on the bottom)
C0603 = smd 1.1 x 1: 1 -0.85,0; 2 0.85,0
153CLV-1012 = smd 4.3 x 2.5: + 4.15,0; - -4.15,0
153CLV-0810 = smd 3.5 x 2.5: + 3.25,0; - -3.25,0
C0805 = smd 1.3 x 1.5: 1 -0.95,0; 2 0.95,0
SC_1F/5V5 = drill 1.2 pad 2.184 square: 1 3,0 | drill 1.2 pad 2.184 octagon: 2 -3,0
C150-064X183 = drill 1.016 octagon: 1 -7.493,0; 2 7.493,0
MICROMELF-W = smd 0.9 x 1.4: A 0.95,0; C -0.95,0
SMB-DIODE = smd 2.4 x 2.4: A 2.2,0; C -2.2,0
POWERDI5-3 = smd 1.39 x 1.4: 1 0.92,-2.856; 2 -0.92,-2.856 | smd 3.36 x 4.86: 3 0,1.126
BV_240X170-HOLE = hole 3.2: 0,3.72
UFQFPN48 = smd 1.15 x 0.29: 1 -3.68,2.75; 2 -3.68,2.25; 3 -3.68,1.75; 4 -3.68,1.25; 5 -3.68,0.75; 6 -3.68,0.25; 7 -3.68,-0.25; 8 -3.68,-0.75; 9 -3.68,-1.25; 10 -3.68,-1.75; 11 -3.68,-2.25; 12 -3.68,-2.75; 25 3.68,-2.75; 26 3.68,-2.25; 27 3.68,-1.75; 28 3.68,-1.25; 29 3.68,-0.75; 30 3.68,-0.25; 31 3.68,0.25; 32 3.68,0.75; 33 3.68,1.25; 34 3.68,1.75; 35 3.68,2.25; 36 3.68,2.75 | smd 0.29 x 1.15: 13 -2.75,-3.68; 14 -2.25,-3.68; 15 -1.75,-3.68; 16 -1.25,-3.68; 17 -0.75,-3.68; 18 -0.25,-3.68; 19 0.25,-3.68; 20 0.75,-3.68; 21 1.25,-3.68; 22 1.75,-3.68; 23 2.25,-3.68; 24 2.75,-3.68; 37 2.75,3.68; 38 2.25,3.68; 39 1.75,3.68; 40 1.25,3.68; 41 0.75,3.68; 42 0.25,3.68; 43 -0.25,3.68; 44 -0.75,3.68; 45 -1.25,3.68; 46 -1.75,3.68; 47 -2.25,3.68; 48 -2.75,3.68 | smd 5.6 x 5.6: EXP 0,0
SOT23-5 = smd 0.55 x 1.2: 1 -0.95,-1.3; 2 0,-1.3; 3 0.95,-1.3; 4 0.95,1.3; 5 -0.95,1.3
PC817SMD = smd 1.68 x 1.71: 1 -4.695,1.27; 2 -4.695,-1.27; 3 4.695,-1.27; 4 4.695,1.27
TDFN-8 = smd 0.8 x 0.29: 1 -1.45,0.75; 2 -1.45,0.25; 3 -1.45,-0.25; 4 -1.45,-0.75; 5 1.45,-0.75; 6 1.45,-0.25; 7 1.45,0.25; 8 1.45,0.75 | smd 1.6 x 1.6: 9 0,0
SO08 = smd 0.61 x 2.21: 1 -1.905,-2.616; 2 -0.635,-2.616; 3 0.635,-2.616; 4 1.905,-2.616; 5 1.905,2.616; 6 0.635,2.616; 7 -0.635,2.616; 8 -1.905,2.616
XHS-7-RA = drill 1 pad 1.778: 1 7.62,0; 2 5.08,0; 3 2.54,0; 4 0,0; 5 -2.54,0; 6 -5.08,0; 7 -7.62,0
XHS-6-RA = drill 1 pad 1.778: 1 6.35,0; 2 3.81,0; 3 1.27,0; 4 -1.27,0; 5 -3.81,0; 6 -6.35,0
XHS-6-VERT-SMD = smd 1.27 x 8: 1 6.35,0.5; 2 3.81,0.5; 3 1.27,0.5; 4 -1.27,0.5; 5 -3.81,0.5; 6 -6.35,0.5
XHS-4-RA = drill 1 pad 1.778: 1 3.81,0; 2 1.27,0; 3 -1.27,0; 4 -3.81,0
XHS-3-RA = drill 1 pad 1.778: 1 2.54,0; 2 0,0; 3 -2.54,0
MICRO_MATCH_04 = drill 0.8 pad 1.422 octagon: 1 0,0; 2 1.27,2.54; 3 2.54,0; 4 3.81,2.54 | hole 1.2: -1.4,1.8
XHS-8-RA = drill 1 pad 1.778: 1 8.89,0; 2 6.35,0; 3 3.81,0; 4 1.27,0; 5 -1.27,0; 6 -3.81,0; 7 -6.35,0; 8 -8.89,0
XHS-5-RA = drill 1 pad 1.778: 1 5.08,0; 2 2.54,0; 3 0,0; 4 -2.54,0; 5 -5.08,0
AK200S/6 = drill 1.5 long: 1 -12.7,0; 2 -7.62,0; 3 -2.54,0; 4 2.54,0; 5 7.62,0; 6 12.7,0
XHS-2-RA = drill 1 pad 1.778: 1 1.27,0; 2 -1.27,0
L0603 = smd 0.9 x 1.1: 1 -0.794,0; 2 0.794,0
CHIP-LED0805 = smd 1.2 x 1.2: A 0,-1.05; C 0,1.05
SOT23 = smd 1 x 1.4: 1 -0.95,-1.1; 2 0.95,-1.1; 3 0,1.1
QS = drill 0.61 long: 1 -2.54,0; 2 2.54,0
TO220BV = drill 1.016 long: D 0,-2.54; G -2.54,-2.54; S 2.54,-2.54
PG-TO263-7-1 = smd 0.8 x 4.6: 1 -3.81,-4.45; 2 -2.54,-4.45; 3 -1.27,-4.45; 4 0,-4.45; 5 1.27,-4.45; 6 2.54,-4.45; 7 3.81,-4.45 | smd 10.8 x 11.25: 8 0,5.625
SOT23-W = smd 1.2 x 1.4: 1 -1.1,-1.3; 2 1.1,-1.3 | smd 2.8 x 1.4: 3 0,1.3
R0603 = smd 1 x 1.1: 1 -0.85,0; 2 0.85,0
SJ_2S-TRACE_THICK = smd 0.5 x 0.5: 1 -0.381,0; 2 0.381,0
SJS = smd 0.762 x 1.016: 1 -0.635,0; 2 0.635,0
OKL2T/3W5NC = smd 1.27 x 1.27: 1 -6.2,0; 1@1 -4.57,0; 2 -2.29,6.2; 2@1 -6.2,4.57; 3 0,6.2; 3@1 2.29,6.2; 4 6.2,4.57; 5 6.2,0; 5@1 4.57,0; 6 6.2,-4.57; 6@1 4.57,-4.57; 7 0,-6.2; 7@1 0,-4.57; 8 -2.29,-6.2; 8@1 -2.29,-4.57; 9 -6.2,-4.57; 9@1 -4.57,-4.57; 10 -6.2,-2.29; 10@1 -4.57,-2.29; 11 6.2,-2.29; 11@1 4.57,-2.54; 12 2.29,-6.2; 12@1 2.29,-4.57 | smd 3.75 x 1.5: 2@2 -3.43,4.57; 3@2 1.14,4.57 | smd 1.5 x 3.75: 4@1 4.57,3.43
NME = drill 0.813 long: 1 0,3.81; 2 0,1.27; 3 0,-1.27; 4 0,-3.81
MOD_CP2105_BOARD = smd 1.93 x 1.93: 1 -10.477,8.89; 2 -10.477,6.35; 3 -10.477,3.81; 4 -10.477,1.27; 5 -10.477,-1.27; 6 -10.477,-3.81; 7 -10.477,-6.35; 8 -10.477,-8.89; 9 8.255,10.477; 10 5.715,10.477; 11 3.175,10.477; 12 0.635,10.477; 13 -1.905,10.477
KURRO-LOGO = smd 2.54 x 1.651 rotated 45 bottom: P$1 0,0 | smd 0.635 x 0.635 rotated 45 bottom: P$2 1.347,1.347

### Placement (x,y rotation side)
C101  63.82,23.18 270 bottom
C102  76.2,21.59 180 bottom
C103  72.39,21.59 0 bottom
C104  77.15,29.21 90 top
C105  70.17,32.7 0 top
C106  76.2,35.88 270 top
C107  70.17,35.24 0 top
C201  22.54,31.11 180 top
C202  33.97,31.43 270 top
C203  40.01,26.99 270 top
C204  46.04,44.13 180 top
C205  16.51,74.93 90 top
C206  92.08,73.34 90 bottom
C207  92.08,68.26 270 bottom
C208  23.5,74.93 90 top
D101  68.9,23.18 90 bottom
D102  81.92,20.32 270 bottom
D201  40.01,30.8 90 top
D202  42.86,32.38 0 top
D203  41.27,59.69 0 top
D204  13.34,64.77 0 bottom
D206  13.34,72.39 0 bottom
D207  3.81,58.42 270 bottom
D208  16.19,53.98 180 bottom
D301  37.78,12.38 270 top
D302  46.35,29.21 90 top
D303  48.9,29.21 90 top
D304  18.41,94.3 180 bottom
D305  55.24,89.53 180 bottom
D306  55.24,87 180 bottom
D307  35.56,92.08 180 bottom
D308  35.56,94.3 180 bottom
D401  12.38,33.02 270 top
D402  15.88,89.53 270 top
H201  41.27,67.31 0 top
IC101  73.98,32.38 90 bottom
IC201  38.73,23.18 270 top
IC202  46.04,39.05 270 bottom
IC203  26.67,50.8 0 top
IC204  17.14,55.88 0 top
IC205  68.9,50.48 180 top
IC206  68.9,45.09 180 top
IC301  11.43,36.83 0 bottom
IC302  90.17,90.17 90 top
IC303  15.88,22.23 270 bottom
IC304  78.74,6.99 180 top
IC305  78.74,12.06 180 top
J401  7.62,38.1 90 top
J402  7.62,17.14 90 top
J403  87.31,40.96 90 top
J404  24.77,7.62 180 top
J405  13.34,92.08 0 top
J406  65.41,93.98 0 top
J407  74.93,93.98 0 top
J408  48.9,92.08 0 top
J409  27.94,92.08 0 top
J410  38.1,7.62 180 top
J411  8.26,69.85 90 top
J412  12.06,7.62 180 top
L101  66.67,35.24 180 top
L102  85.09,30.16 270 top
L301  37.78,16.19 90 top
Q1  -5.71,46.04 270 bottom  (outside the outline)
Q101  74.3,23.81 0 top
Q201  14.92,44.77 270 top
Q202  41.27,67.31 0 top
Q203  13.34,57.15 270 bottom
Q204  78.11,67.31 0 top
Q205  64.77,67.31 0 top
Q206  92.08,62.55 0 bottom
Q301  60.33,32.7 90 top
R101  66.36,23.18 90 bottom
R102  78.42,32.07 180 top
R103  85.09,27.94 0 top
R104  81.92,24.13 90 bottom
R105  79.38,24.13 90 bottom
R201  32.07,9.53 0 top
R202  42.86,40.96 90 bottom
R203  10.79,45.72 180 top
R204  19.05,51.44 90 top
R205  38.73,55.88 0 top
R206  42.55,55.88 0 top
R207  15.88,51.44 270 top
R208  19.68,57.15 90 bottom
R209  17.14,57.15 270 bottom
R210  93.03,58.74 270 bottom
R211  76.52,49.21 0 top
R212  76.52,43.81 0 top
R213  78.74,57.47 270 top
R214  81.28,57.47 270 top
R215  65.41,57.47 270 top
R216  67.94,57.47 270 top
R301  15.88,38.1 180 bottom
R302  15.88,35.56 180 bottom
R303  88.9,85.72 270 top
R304  91.44,85.72 270 top
R305  63.82,32.7 90 top
R306  51.44,29.21 270 top
R307  53.98,29.21 270 top
R308  21.59,22.23 180 bottom
R309  10.16,22.23 270 bottom
R310  86.36,5.71 0 top
R311  86.36,10.79 0 top
SJ101  68.74,19.37 270 bottom
SJ102  71.28,38.26 180 bottom
SJ201  23.5,57.15 0 top
SJ202  86.68,69.53 180 bottom
SJ401  82.55,96.52 180 top
U201  28.57,18.1 0 top
U203  89.53,70.8 0 top
U301  55.24,15.88 270 top
U$1  87.63,16.29 90 bottom

### Tracks (layer width: path | path; a pad name or v marks a point on that pad's centre or on a via)
!RST  (via drill 0.3)
  Top 0.381: D303.A 48.9,31.75 48.26,32.38 46.35,32.38 44.45,30.48 44.45,25.08 v45.72,23.81
  Bottom 0.254: 72.39,25.08 69.85,25.08 D101.A
  Bottom 0.279: IC101.7 73.73,26.42 72.39,25.08
  Bottom 0.381: D101.A 66.46,24.13 R101.2 C101.1 63.6,23.81 v45.72,23.81
+3V3  (via drill 0.3)
  Top 0.445: D202.A | v53.98,35.24 46.67,35.24 D202.A | IC201.5 v41.91,24.13 43.66,25.88 43.66,32.23 D202.A | v59.05,35.24 61.12,35.24 61.59,34.77 61.59,33.83 Q301.2 61.88,33.55 R305.2 64.19,33.55 L101.2
  Bottom 0.318: IC303.8 14.61,24.13 16.19,22.54 16.19,19.37 16.83,18.73 37.15,18.73 41.91,23.5 v41.91,24.12 v41.91,24.13
  Bottom 0.445: v53.98,35.24 v59.05,35.24
+5V  (via drill 0.3)
  Top 0.254: IC302.3 90.42,87.56 90.17,87.31
  Top 0.318: 90.17,87.31 90.17,82.55 89.53,81.92 86.68,81.92 78.42,90.17 56.2,90.17 55.24,91.12 J408.2
  Top 0.445: v33.97,29.21 26.35,36.83 v18.41,36.83 v15.24,40.01 | v39.69,16.83 37.94,16.83 L301.2
  Top 0.61: L301.2 37.78,17.46 36.2,19.05 35.73,19.05 U201.5
  Top 0.635: v11.43,48.26 3.17,56.52 3.17,85.41 6.35,88.58 D402.A 16.83,88.58 23.5,95.25 53.34,95.25 55.24,93.34 J408.2
  Bottom 0.279: IC301.3 13.72,36.58 13.97,36.83
  Bottom 0.318: 47.31,38.07 IC202.3 | 13.97,36.83 v18.41,36.83
  Bottom 0.445: IC202.3 48.26,38.1 48.58,38.42 48.58,39.69 48.26,40 IC202.1 | v33.97,29.21 39.05,29.21 47.31,37.47 47.31,38.07 | v15.24,40.01 15.24,44.45 v11.43,48.26 | D102.A 81.92,18.73 80.01,16.83 v39.69,16.83
  pour Top (isolate 0.508, rank 3, no thermals): 32.38,17.46 34.92,17.46 37.78,20.32 37.78,27.3 35.24,29.84 32.38,29.84
+5V_ISOL  (via drill 0.3)
  Top 0.445: IC205.4 62.87,49.21 v62.23,49.85
  Top 0.635: Q205.3 v63.5,59.05 | v76.83,61.28 Q204.3 | IC206.4 65.09,43.81 66.04,44.77 66.04,48.58 65.41,49.21 IC205.4
  Bottom 0.445: v62.23,49.85 62.23,57.78 v63.5,59.05
  Bottom 0.635: C207.2 91.66,66.99 U203.4 82.55,66.99 v76.83,61.28 73.66,58.1 64.45,58.1 v63.5,59.05
+12V  (via drill 0.3)  (4 unrouted)
  Top 0.635: U201.2 23.66,24.3 18.57,19.21 v18.57,8.89 | v97.16,67.94 97.16,69.22 94.93,71.44 90.17,71.44 U203.2
  Bottom 0.61: 92.71,33.97 97.16,38.42 v97.16,67.94
  Bottom 0.635: U203.2 91.66,72.07 C206.1 | v18.57,8.89 18.57,6.83 19.68,5.71 89.53,5.71 92.71,8.89 92.71,33.97
  pour Top (isolate 0.508, rank 3, no thermals): 11.11,34.61 11.11,31.43 20.95,21.59 26.99,21.59 26.99,24.77 20.64,31.11 20.64,32.38 18.41,34.61
+24V  (via drill 0.6)
  Top 0.318: 23.88,57.15 24.77,57.15
  Top 0.61: Q205.7 68.58,63.82 69.22,64.45 | Q204.7 81.92,63.5 82.55,64.14
  Top 1.587: 82.55,64.45 82.55,64.14 82.55,60.96 84.14,59.37 84.14,55.24 83.19,54.29 71.12,54.29 70.48,54.93 | 70.48,54.93 69.85,54.29 62.23,54.29 60.01,52.07 39.05,52.07 33.34,46.35 29.84,46.35 24.77,51.44 24.77,57.15 v24.77,69.22 | 70.48,54.93 70.48,59.37 69.22,60.64 69.22,64.45
  other vias: 25.72,67.47 12.06,78.42 13.97,77.15 15.56,78.42 17.14,77.15 17.14,74.93 20,77.15 17.14,72.71 20,74.93 22.23,74.93 22.23,72.71 20,72.71 22.23,70.48 20,70.48
  pour Bottom (isolate 0.635, no thermals): 5.4,71.75 6.35,70.8 18.41,70.8 23.5,65.72 26.35,65.72 27.3,66.67 27.3,75.56 26.35,76.52 23.81,79.38 6.67,79.38 5.4,78.11
  pour Top (isolate 0.635, rank 3, no thermals): 22.23,66.36 26.35,66.36 27.3,67.31 27.3,68.26 25.72,69.85 23.18,69.85 22.23,68.9
  pour Top (isolate 0.635, rank 3, no thermals): 5.4,71.75 6.35,70.8 18.41,70.8 23.5,65.72 26.35,65.72 27.3,66.67 27.3,70.17 18.1,79.38 6.67,79.38 5.4,78.11
+24V_FROM_SSR  (via drill 0.3)
  Bottom 0.61: D207.C 3.81,64.14 6.99,67.31 J411.3
  other vias: 11.11,65.72 11.11,66.67 11.11,67.63 11.11,68.58
  pour Bottom (isolate 0.635, rank 2, no thermals): 5.4,66.67 6.35,65.72 6.67,65.41 10.16,65.41 11.75,63.82 16.83,63.82 19.68,66.67 19.68,67.94 17.78,69.85 6.99,69.85 5.4,68.26
  pour Top (isolate 0.635, rank 3, no thermals): 5.4,66.67 6.67,65.41 17.46,65.41 18.41,66.36 18.41,68.26 17.46,69.22 6.35,69.22 5.4,68.26
AGND  (via drill 0.3, 3)
  Top 0.279: C105.2 73.66,32.7 IC101.EXP | C107.2 72.07,35.24 73.98,33.34 IC101.EXP | C106.2 76.2,34.61 IC101.EXP | R102.2 74.3,32.07
  Top 0.445: v74.3,23.02 74.3,31.91 | 74.3,31.91 74.3,32.07 IC101.EXP | C104.2 76.14,30.06 74.3,31.91
  Bottom 0.445: C101.2 63.82,22.07 65.88,20 68.48,20 SJ101.1 68.99,20 72.39,20 73.18,20.8 73.18,21.53 C103.1 74.3,22.64 | v74.3,23.02 74.3,22.64 | 74.3,22.64 C102.1
  other vias: 73.98,32.38
AZ_ZERO  (via drill 0.3)
  Top 0.318: v66.04,28.57 66.04,23.5 70.17,19.37 85.72,19.37 95.89,29.53 95.89,35.24 v96.2,35.56
  Bottom 0.254: IC101.15 68.1,30.64 v66.04,28.57
  Bottom 0.381: D304.A 26.35,94.3 29.84,97.79 58.74,97.79 64.77,91.76 86.04,91.76 96.84,80.96 96.84,69.85 98.11,68.58 98.11,37.47 v96.2,35.56
BOOT0  (via drill 0.3)
  Top 0.279: R102.1 79.27,31.01 v79.22,30.96
  Top 0.318: Q301.3 59.02,33.21 58.1,34.13 58.1,36.2 59.53,37.62 74.61,37.62 75.88,38.89 78.11,38.89 79.38,37.62 79.38,32.17 R102.1
  Bottom 0.279: IC101.46 78.89,30.64 v79.22,30.96
BUS_CANH
  Top 0.406: J401.4 6.67,38.1 4.76,36.2 4.76,29.21 6.35,27.62 8.26,27.62 10.16,25.72 10.16,19.68 8.89,18.41 J402.3
  Bottom 0.279: IC301.7 8.64,37.08 J401.4
BUS_CANL
  Top 0.406: J401.5 6.67,35.56 5.71,34.61 5.71,29.84 6.99,28.57 8.57,28.57 11.11,26.04 11.11,17.46 9.53,15.88 J402.4
  Bottom 0.279: IC301.6 8.64,36.58 J401.5
BUS_RXD
  Bottom 0.254: IC101.33 75.23,40.34 69.22,46.35
  Bottom 0.318: R302.2 18.41,35.56 29.21,46.35 50.8,46.35 69.22,46.35
BUS_TXD
  Bottom 0.254: IC101.34 75.73,40.8 69.53,46.99
  Bottom 0.318: R301.2 20,38.1 28.89,46.99 50.8,46.99 69.53,46.99
CENC_A  (via drill 0.3)
  Top 0.318: v66.99,25.4 66.99,23.5 70.48,20 85.41,20 95.25,29.84 95.25,58.74 87.63,66.36 v87.63,70.8
  Bottom 0.254: 72.07,25.72 67.31,25.72 v66.99,25.4
  Bottom 0.279: IC101.8 73.23,26.87 72.07,25.72
  Bottom 0.445: D305.A 56.83,89.53 58.74,87.63 71.75,87.63 87.63,71.75 v87.63,70.8
CENC_B  (via drill 0.3)
  Top 0.318: v86.68,71.44 v86.68,65.72
  Bottom 0.254: IC101.41 86.47,33.13 93.66,40.32
  Bottom 0.318: 93.66,40.32 93.66,51.12 91.44,53.34 91.44,58.74 86.68,63.5 v86.68,65.72
  Bottom 0.445: D306.A 56.51,86.68 71.44,86.68 v86.68,71.44
COCK_ENC_A
  Bottom 0.445: D305.C 53.98,89.53 52.7,90.81 J408.3
COCK_ENC_B
  Bottom 0.445: D306.C 53.34,87 50.16,90.17 J408.4
COCK_IN_ERECT  (via drill 0.3)
  Top 0.445: IC205.3 v69.53,51.75 | v76.52,58.1 76.52,59.05 75.56,60.01 Q204.2
  Bottom 0.445: v69.53,51.75 70.17,51.75 v76.52,58.1
COCK_IN_RETRACT  (via drill 0.3)
  Top 0.445: Q205.2 62.23,59.69 v61.28,58.74 | v61.28,48.9 61.28,47.94 62.87,46.35 IC206.3
  Bottom 0.445: v61.28,58.74 v61.28,48.9
COCK_PWR_A
  Top 0.813: Q204.4 Q204.8
  pour Top (isolate 0.635, rank 3, no thermals): 48.26,93.03 48.26,90.49 50.16,88.9 77.47,88.9 83.5,82.55 83.5,67.63 73.03,67.63 73.03,77.79 66.04,84.77 48.9,84.77 44.45,89.22 44.45,93.03 44.77,93.34 47.94,93.34
  pour Bottom (isolate 0.635, rank 4, no thermals): 44.77,93.34 44.45,93.03 44.45,91.12 45.09,90.49 47.62,90.49 48.26,91.12 48.26,93.03 47.94,93.34
COCK_PWR_B
  Top 0.813: Q205.4 Q205.8
  pour Top (isolate 0.635, rank 4, no thermals): 43.5,92.71 43.5,89.22 48.9,83.82 65.41,83.82 70.17,79.06 70.17,67.31 59.37,67.31 59.37,78.74 57.47,80.64 46.04,80.64 38.73,87.95 38.73,92.71 39.37,93.34 42.86,93.34
  pour Bottom (isolate 0.635, rank 3, no thermals): 39.37,93.34 38.73,92.71 38.73,91.44 39.37,90.81 43.18,90.81 43.18,92.71 42.55,93.34
COCK_PWR_ENABLE  (via drill 0.3)
  Top 0.318: v67.94,28.57 67.94,23.5 70.8,20.64 85.09,20.64 94.61,30.16 94.61,48.9 93.03,50.48 v93.03,53.02
  Bottom 0.254: IC101.13 70.28,29.64 69.53,28.89 68.26,28.89 v67.94,28.57
  Bottom 0.318: R210.2 v93.03,53.02
COCK_PWR_ERECT  (via drill 0.3)
  Top 0.318: v68.9,29.84 68.9,23.5 71.12,21.27 84.77,21.27 93.98,30.48 93.98,47.62 92.08,49.53 77.79,49.53 77.47,49.21 R211.2
  Bottom 0.254: IC101.14 69.19,30.14 v68.9,29.84
COCK_PWR_RETRACT  (via drill 0.3)
  Top 0.318: v70.48,28.57 70.48,22.86 71.44,21.91 84.45,21.91 93.34,30.8 93.34,47.31 91.76,48.9 82.55,48.9 77.47,43.81 R212.2
  Bottom 0.254: IC101.12 70.61,28.7 v70.48,28.57
COCK_SENSOR1
  Top 0.635: Q204.6 80.64,58.95 R214.1
GND  (via drill 0.3)  (55 unrouted)
  Top 0.279: IC302.2 89.92,89.92 | IC302.8 89.42,90.92 IC302.9
  Top 0.318: 89.92,89.92 IC302.9
  Top 0.406: 38.42,23.18 38.73,23.5 38.73,24.77 C203.2
  Top 0.445: IC201.2 38.42,23.18 38.73,22.86 38.73,20.95 39.69,20
  Bottom 0.279: IC301.8 10.68,37.58 IC301.9 11.68,37.08 IC301.2
  Bottom 0.318: IC202.2 46.35,39.05 46.04,39.37 46.04,41.13 C204.2
  Bottom 0.445: 68.74,19.75 68.74,17.94 68.9,17.78
  other vias: 28.57,26.67 30.48,21.27 40.64,20 83.19,27.94 83.5,34.61 74.93,46.35 89.53,62.55 88.27,52.39 21.91,47.94 68.58,11.75 56.52,28.89 89.22,79.06 33.34,37.47 2.86,16.83 58.1,9.84 52.7,21.91 58.1,1.27 91.12,3.17 89.22,29.21 84.45,96.52
  pour Top (isolate 0.508, rank 6, no thermals): 0,0 100.01,0 100.01,100.01 0,100.01
  pour Bottom (isolate 0.508, rank 6, no thermals): 0,0 100.01,0 100.01,100.01 0,100.01
IMU_485_A
  Top 0.406: J401.3 6.67,40.64 3.81,37.78 3.81,28.89 6.03,26.67 7.62,26.67 9.21,25.08 9.21,21.59 8.57,20.95 J402.2
  Bottom 0.406: IC303.6 10.38,21.59 R309.2 9.74,20.95 J402.2
IMU_485_B
  Top 0.406: J401.2 6.67,43.18 2.86,39.37 2.86,28.57 7.62,23.81 J402.1
  Bottom 0.406: IC303.7 10.38,22.86 R309.1 9.74,23.5 J402.1
IMU_DE
  Bottom 0.279: 20.11,21.59 R308.1 20.11,22.86 IC303.2 | IC101.9 72.73,27.17 71.91,26.35 66.99,26.35
  Bottom 0.318: 20.11,21.59 IC303.3 17.46,21.59 16.83,20.95 16.83,19.68 17.14,19.37 23.81,19.37 30.8,26.35 66.99,26.35
IMU_RXD
  Bottom 0.279: IC101.10 72.23,27.62 71.6,26.99 66.99,26.99
  Bottom 0.318: IC303.4 23.81,20.32 30.48,26.99 66.99,26.99
IMU_TXD
  Bottom 0.279: IC101.11 71.73,27.91 71.44,27.62 66.99,27.62
  Bottom 0.318: 66.99,27.62 27.94,27.62 24.45,24.13 IC303.1
JUP_EL_+5V
  Top 0.635: J410.1 35.56,7.3 39.05,3.81 68.58,3.81 70.48,5.71 IC304.4 74.93,5.71 75.88,6.67 75.88,9.84 74.93,10.79 IC305.4
LIM_AZ_ZERO
  Bottom 0.635: D304.C 15.56,94.3 J405.2
LIM_EL_DOWN  (via drill 0.3)
  Top 0.381: v91.44,15.24 87.21,11.01 R311.2
  Bottom 0.381: J409.4 30.48,97.16 58.26,97.16 64.45,90.96 85.72,90.96 96.2,80.49 96.2,39.05 91.44,34.29 v91.44,15.24
LIM_EL_DOWN_ISOL
  Top 0.635: J410.2 39.69,9.21 41.91,9.21 45.4,5.71 67.31,5.71 71.44,9.84 71.44,11.75 73.03,13.34 IC305.3
LIM_EL_UP  (via drill 0.3)
  Top 0.381: v90.49,12.7 90.49,8.99 R310.2
  Bottom 0.381: J409.3 32.38,96.52 57.94,96.52 64.14,90.33 85.41,90.33 95.57,80.17 95.57,39.37 90.49,34.29 v90.49,12.7
LIM_EL_UP_ISOL
  Top 0.635: IC304.3 71.44,8.26 67.94,4.76 43.5,4.76 J410.3
MTR_CANH
  Top 0.279: IC302.7 89.92,92.33 88.27,93.98
  Top 0.318: J407.3 88.27,93.98
  Bottom 0.406: J406.3 71.44,93.98 73.03,92.39 75.88,92.39 J407.3
MTR_CANL
  Top 0.279: IC302.6 90.42,92.78 85.09,98.11
  Top 0.318: J407.2 76.52,96.52 78.11,98.11 85.09,98.11
  Bottom 0.406: J406.2 68.26,98.11 74.61,98.11 J407.2
MTR_RXD  (via drill 0.3)
  Top 0.318: v91.44,81.92 R304.2
  Bottom 0.254: IC101.43 86.43,32.13 94.3,40.01
  Bottom 0.318: 94.3,40.01 94.3,79.06 v91.44,81.92
MTR_TXD  (via drill 0.3)
  Top 0.318: R303.2 88.9,83.19 v89.22,82.87
  Bottom 0.254: IC101.44 86.88,31.64 94.93,39.69
  Bottom 0.318: v89.22,82.87 91.76,82.87 94.93,79.69 94.93,39.69
MUNC_A  (via drill 0.3)
  Top 0.318: v69.22,40.01 v69.22,47.94 | v75.88,51.44 84.14,51.44 86.68,53.98 86.68,60.33 85.72,61.28 85.72,74.3 86.04,74.61 v86.04,74.93
  Bottom 0.254: IC101.24 69.96,35.13 69.06,36.04 69.06,39.85 v69.22,40.01
  Bottom 0.318: v75.88,51.44 72.71,51.44 v69.22,47.94
  Bottom 0.445: D308.A 38.1,94.3 39.37,95.57 57.78,95.57 63.82,89.53 72.39,89.53 86.04,75.88 v86.04,74.93
MUNC_B  (via drill 0.3)
  Top 0.318: v85.09,75.56 85.09,60.96 86.04,60.01 86.04,54.29 84.14,52.39 v77.79,52.39 | v70.17,40.01 70.17,50.16 v71.44,51.44
  Bottom 0.254: IC101.25 71.23,36.41 70.96,36.67 70.33,36.67 69.69,37.31 69.69,39.05 70.17,39.53 v70.17,40.01
  Bottom 0.318: v77.79,52.39 72.39,52.39 v71.44,51.44
  Bottom 0.445: D307.A 37.15,92.08 39.69,94.61 57.47,94.61 63.5,88.58 72.07,88.58 v85.09,75.56
MUNITION_COUNTER_A
  Bottom 0.635: D308.C 32.7,94.3 J409.2
MUNITION_COUNTER_B
  Bottom 0.635: D307.C J409.1
N$1
  Top 0.318: IC204.4 23.11,57.15 | IC203.4 31.11,52.07 26.04,57.15 SJ201.2
N$2
  Top 0.635: D402.C J405.1
N$3
  Top 0.61: IC304.1 R310.1
N$4  (via drill 0.3)
  Top 0.635: L102.A v82.87,30.16
  Bottom 0.254: IC101.47 82.84,30.14 v82.87,30.16
N$5
  Top 0.635: Q204.5 79.38,58.95 R213.1
N$6
  Top 0.635: Q205.5 66.04,58.95 R215.1
N$7
  Top 0.635: Q205.6 67.31,58.95 R216.1
N$8
  Top 0.61: R307.2 U301.5
N$9
  Top 0.635: L102.C 86.14,28.14 R103.2
N$10
  Top 0.61: R306.2 U301.6
N$11
  Bottom 0.445: R104.1 D102.C
N$12
  Top 0.61: D303.C U301.7
N$13
  Top 0.61: D302.C U301.8
N$14
  Top 0.61: L301.1 D301.C 41.59,13.34 42.23,12.7 52.07,12.7 64.14,24.77 U301.1
N$15
  Bottom 0.445: Q206.1 R210.1
N$16
  Bottom 0.445: C206.2 92.5,74.19 93.34,73.34 93.34,64.92 Q206.3
  Bottom 0.635: U203.1 91.66,74.61 C206.2
N$17
  Top 0.635: R203.1 Q201.1
N$18
  Top 0.635: IC205.1 R211.1
N$19
  Top 0.61: U201.6 U201.6@1 33.15,9.75 R201.2
N$20  (via drill 0.3)
  Top 0.381: D302.A 46.35,30.8 v46.99,31.43 | R305.1 63.08,31.11 v62.87,31.11 62.38,31.6 Q301.1
  Bottom 0.381: v46.99,31.43 62.55,31.43 v62.87,31.11
N$21
  Top 0.61: IC305.1 R311.1
N$22
  Top 0.635: IC206.1 R212.1
N$23
  Top 0.406: SJ401.2 J407.4
  Bottom 0.406: J406.1 66.04,93.98 68.58,96.52 J406.4 70.48,96.52 73.03,93.98 J407.1 75.56,93.98 78.11,96.52 J407.4
N$24
  Bottom 0.635: C207.1 91.66,69.53 U203.3 87.06,69.53
N$25
  Bottom 0.279: IC101.6 74.23,25.65 72.39,23.81 Q101.1
  Bottom 0.318: C103.2 71.54,23.6 Q101.1
N$26
  Bottom 0.254: IC101.26 71.73,36.86 71.28,37.31 70.8,37.31 70.64,37.47 SJ102.1
N$31
  Bottom 0.279: IC101.5 74.73,25.6 76.52,23.81 Q101.2
  Bottom 0.318: C102.2 77.05,23.6 Q101.2
N$33
  Top 0.61: D401.1 9.53,31.11 12.38,28.26 12.38,16.51 9.21,13.34 J402.5
  pour Top (isolate 0.508, rank 4, no thermals): 6.67,33.66 6.67,32.38 6.99,32.07 8.26,32.07 8.89,31.43 9.84,31.43 9.84,34.61 8.89,34.61 8.26,33.97 6.99,33.97
N$34
  Bottom 0.279: IC301.4 14.51,36.08 R302.1
N$35
  Bottom 0.279: IC301.1 14.51,37.58 R301.1
N$36
  Top 0.279: IC302.4 90.92,87.09 R304.1
N$37
  Top 0.279: IC302.1 89.42,87.09 R303.1
N$38
  Top 1.016: Q202.G 38.73,60.03 D203.C 39.59,59.18 R205.2 R206.1
N$40  (1 unrouted)
  Bottom 0.61: Q203.1 17.05,58.1 R209.1 R208.2
N$41
  Top 0.635: IC203.3 32.7,49.53 37.88,54.71 R205.1
N$42  (via drill 0.6)
  Top 0.635: IC204.3 v20,54.61
  Bottom 0.635: v20,54.61 19.68,54.93 R208.1
N$43
  Top 0.635: IC204.1 13.65,57.15 15.88,54.93 R207.1
N$44
  Top 0.635: R204.2 21.76,52.28 IC203.1
N$46
  Bottom 0.635: IC202.5 42.97,40 R202.1
PROG_USB_D+  (via drill 0.3)
  Top 0.406: U301.2 61.59,24.13 51.44,13.97 v42.86,13.97
  Bottom 0.406: v42.86,13.97 29.53,13.97 26.04,10.48 J404.3
PROG_USB_D-  (via drill 0.3)
  Top 0.406: U301.3 59.05,23.5 50.8,15.24 v41.59,15.24
  Bottom 0.406: v41.59,15.24 29.53,15.24 23.5,9.21 J404.2
PROG_USB_V+
  Top 0.61: J404.1 20.95,6.99 22.23,5.71 31.43,5.71 37.15,11.43 D301.A
SWCLK  (via drill 0.3)
  Top 0.279: J403.5 v83.5,37.15
  Bottom 0.254: IC101.37 81.01,35.13 83.03,37.15 v83.5,37.15
SWDIO  (via drill 0.3)
  Top 0.279: v83.5,39.69 J403.4
  Bottom 0.279: IC101.36 76.73,36.41 80.01,39.69 v83.5,39.69
SYS_WKUP2
  Bottom 0.279: IC101.2 76.23,26.59 77.84,24.98 R105.2
  Bottom 0.318: R105.2 R104.2
T_HOLD  (via drill 0.3)
  Top 0.318: R207.2 15.88,50.48 22.54,43.81 34.92,43.81 40.64,49.53 52.7,49.53 v59.69,42.55
  Bottom 0.254: v59.69,42.55 70.8,42.55 73.23,40.12 IC101.29
T_JS_PULSE  (via drill 0.3)
  Top 0.318: Q201.3 20.64,44.77 22.23,43.18 35.24,43.18 40.96,48.9 52.07,48.9 v59.37,41.59
  Bottom 0.254: v59.37,41.59 59.69,41.27 70.17,41.27 71.91,39.53 SJ102.2 72.23,37.95 IC101.27
T_START  (via drill 0.3)
  Top 0.318: R204.1 19.05,48.26 22.86,44.45 34.61,44.45 40.32,50.16 53.34,50.16 60.64,42.86 v60.64,41.91
  Bottom 0.254: v60.64,41.91 70.48,41.91 72.73,39.67 IC101.28
TRIGGER_BUS_PULSE
  Top 0.635: R203.2 J401.1
TRIGGER_ENABLE  (via drill 0.3)
  Top 0.318: v81.6,33.97 83.82,31.75 86.68,31.75 87.95,30.48 v87.95,26.99
  Top 0.635: J412.2 13.34,7.3 17.78,2.86 87.95,2.86 92.71,7.62 92.71,16.83 v89.53,20
  Bottom 0.254: IC101.38 80.94,34.63 v81.6,33.97
  Bottom 0.318: v87.95,26.99 87.95,21.59 v89.53,20
TRIGGER_HOLD  (1 unrouted)
  Bottom 0.61: D207.A 4.13,57.15 J411.1 Q203.3
  Bottom 0.635: D208.C 13.65,53.98 12.06,55.56 12.06,56.98 Q203.3
  pour Top (isolate 0.635, rank 5, no thermals): 5.4,56.52 6.35,55.56 9.84,55.56 10.48,56.2 10.48,58.1 9.84,58.74 6.03,58.74 5.4,58.1
TRIGGER_START  (via drill 0.3, 0.6)
  other vias: 15.88,61.91 16.83,60.96 17.78,61.91 11.11,61.91 11.11,60.64 12.06,60.64 13.02,60.64 13.97,60.64 14.92,60.64
  pour Bottom (isolate 0.635, rank 3, no thermals): 6.35,63.82 5.4,62.87 5.4,61.28 6.35,60.33 40.32,60.33 42.55,62.55 42.55,65.72 41.59,66.67 40.64,67.63 29.84,67.63 25.08,62.87 11.43,62.87 10.48,63.82
  pour Top (isolate 0.635, rank 4, no thermals): 5.4,61.28 6.35,60.33 17.46,60.33 18.41,61.28 18.41,63.18 17.46,64.14 6.67,64.14 5.4,62.87
V-  (via drill 0.6)  (23 unrouted)
  Top 0.635: R214.2 R213.2 76.42,56.62 74.3,58.74 Q204.1 | R216.2 R215.2 61.49,56.62 60.01,58.1 v60.01,61.28
  Bottom 0.61: Q203.2 17.05,56.2 R209.2
  Bottom 0.635: Q202.S 43.81,60.96 35.88,53.02 18.09,53.02 D208.A R209.2 | SJ202.2 83.19,69.53 74.93,61.28 v73.34,61.28
  Bottom 1.587: v60.01,64.45 51.75,64.45 48.58,67.63 46.67,67.63 Q202.S
  other vias: 73.34,62.87 73.34,64.45 60.01,62.87 12.06,81.28 12.06,83.5 14.29,83.5 14.29,81.28 18.41,81.28 18.41,83.5 21.27,83.5 21.27,81.28 25.72,81.28 25.72,83.5
  pour Bottom (isolate 0.635, rank 2, no thermals): 5.4,81.92 6.67,80.64 27.3,80.64 31.43,75.88 43.5,75.88 45.09,74.3 45.09,68.58 42.86,66.36 42.86,63.18 43.81,62.23 45.09,62.23 49.85,66.99 49.85,74.93 40.32,84.45 6.03,84.45 5.4,83.82
  pour Top (isolate 0.61, rank 2, no thermals): 42.55,61.91 42.55,55.56 43.5,54.61 44.45,54.61 45.4,55.56 45.4,66.04 44.77,66.67 43.5,66.67 42.55,65.72
  pour Top (isolate 0.635, rank 3, no thermals): 59.69,65.09 61.28,65.09 61.28,60.64 59.69,60.64 59.05,61.28 59.05,64.45
  pour Top (isolate 0.635, rank 3, no thermals): 73.03,60.64 74.61,60.64 74.61,65.09 73.03,65.09 72.39,64.45 72.39,61.28
  pour Bottom (isolate 0.635, rank 3, no thermals): 59.05,61.28 59.05,60.96 59.69,60.33 73.66,60.33 74.3,60.96 74.3,64.77 73.66,65.41 59.69,65.41 59.05,64.77
  pour Top (isolate 0.635, rank 3, no thermals): 5.4,81.92 6.67,80.64 25.72,80.64 26.67,81.6 26.67,83.5 25.72,84.45 6.03,84.45 5.4,83.82
V_SCAP
  Top 0.635: D201.A 40.01,41.1 C204.1
  Bottom 0.635: C204.1 43.04,41.98 R202.2
VCP_RX  (via drill 0.3)
  Top 0.318: J403.1 83.5,47.31 78.42,42.23 75.88,42.23 74.3,40.64 v74.3,40.01 73.66,40.01 72.71,39.05 59.05,39.05 51.44,31.43 R306.1
  Bottom 0.254: IC101.32 74.73,39.57 v74.3,40.01
VCP_TX  (via drill 0.3)
  Top 0.318: J403.2 81.92,44.77 78.74,41.59 77.15,41.59 v73.98,38.42 59.37,38.42 53.98,33.02 R307.1
  Bottom 0.254: IC101.31 74.23,37.53 73.98,37.78 v73.98,38.42
VDD  (via drill 0.3)
  Top 0.279: v83.5,42.23 J403.3 | C106.1 76.2,36.83 76.83,37.47 v76.83,38.1 | C105.1 68.9,32.7 68.26,33.34 v68.26,33.97 | C107.1 69.32,35.03 v68.26,33.97 | L101.1 67.47,34.77 v68.26,33.97 | C104.1 78.05,28.36 v78.26,28.57
  Top 0.445: D201.C 41.27,29.84 41.91,30.48 D202.C 41.91,32.7 45.72,36.51 v55.09,36.51 | v60.33,36.51 66.99,36.51 67.31,36.2 67.31,35.4 L101.1 | v66.36,21.27 66.36,20.95 65.41,20 v61.59,20 | v41.91,25.4 41.91,27.3 41.27,27.94 C203.1
  Top 0.635: C203.1 D201.C
  Bottom 0.279: IC101.35 76.23,37.49 v76.83,38.1 80.96,42.23 v83.5,42.23 | IC101.20 69.1,33.13 v68.26,33.97 | IC101.21 68.6,33.63 v68.26,33.97 | IC101.23 68.92,34.63 v68.26,33.97 | IC101.1 78.13,28.7 v78.26,28.57 78.26,29.21 77.84,29.64 IC101.48
  Bottom 0.445: v55.09,36.51 v60.33,36.51 | v66.36,21.27 R101.1 68.8,22.33 D101.C | v61.59,20 47.31,20 v41.91,25.4
  Bottom 0.635: v78.26,36.67 80.01,36.67 v80.33,36.35
  pour Top (isolate 0.508, rank 4, no thermals): 75.88,27.3 79.38,27.3 81.28,29.21 81.28,35.88 77.47,39.69 67.94,39.69 66.67,38.42 66.67,34.92 74.3,27.3
(copper drawn outside any net)
  shapes: Bottom circle x1

### Text on the board
Top: motorControl_v2.2 / - RESPATI -